# Altium project MultiBoard_Analog.PrjPcb
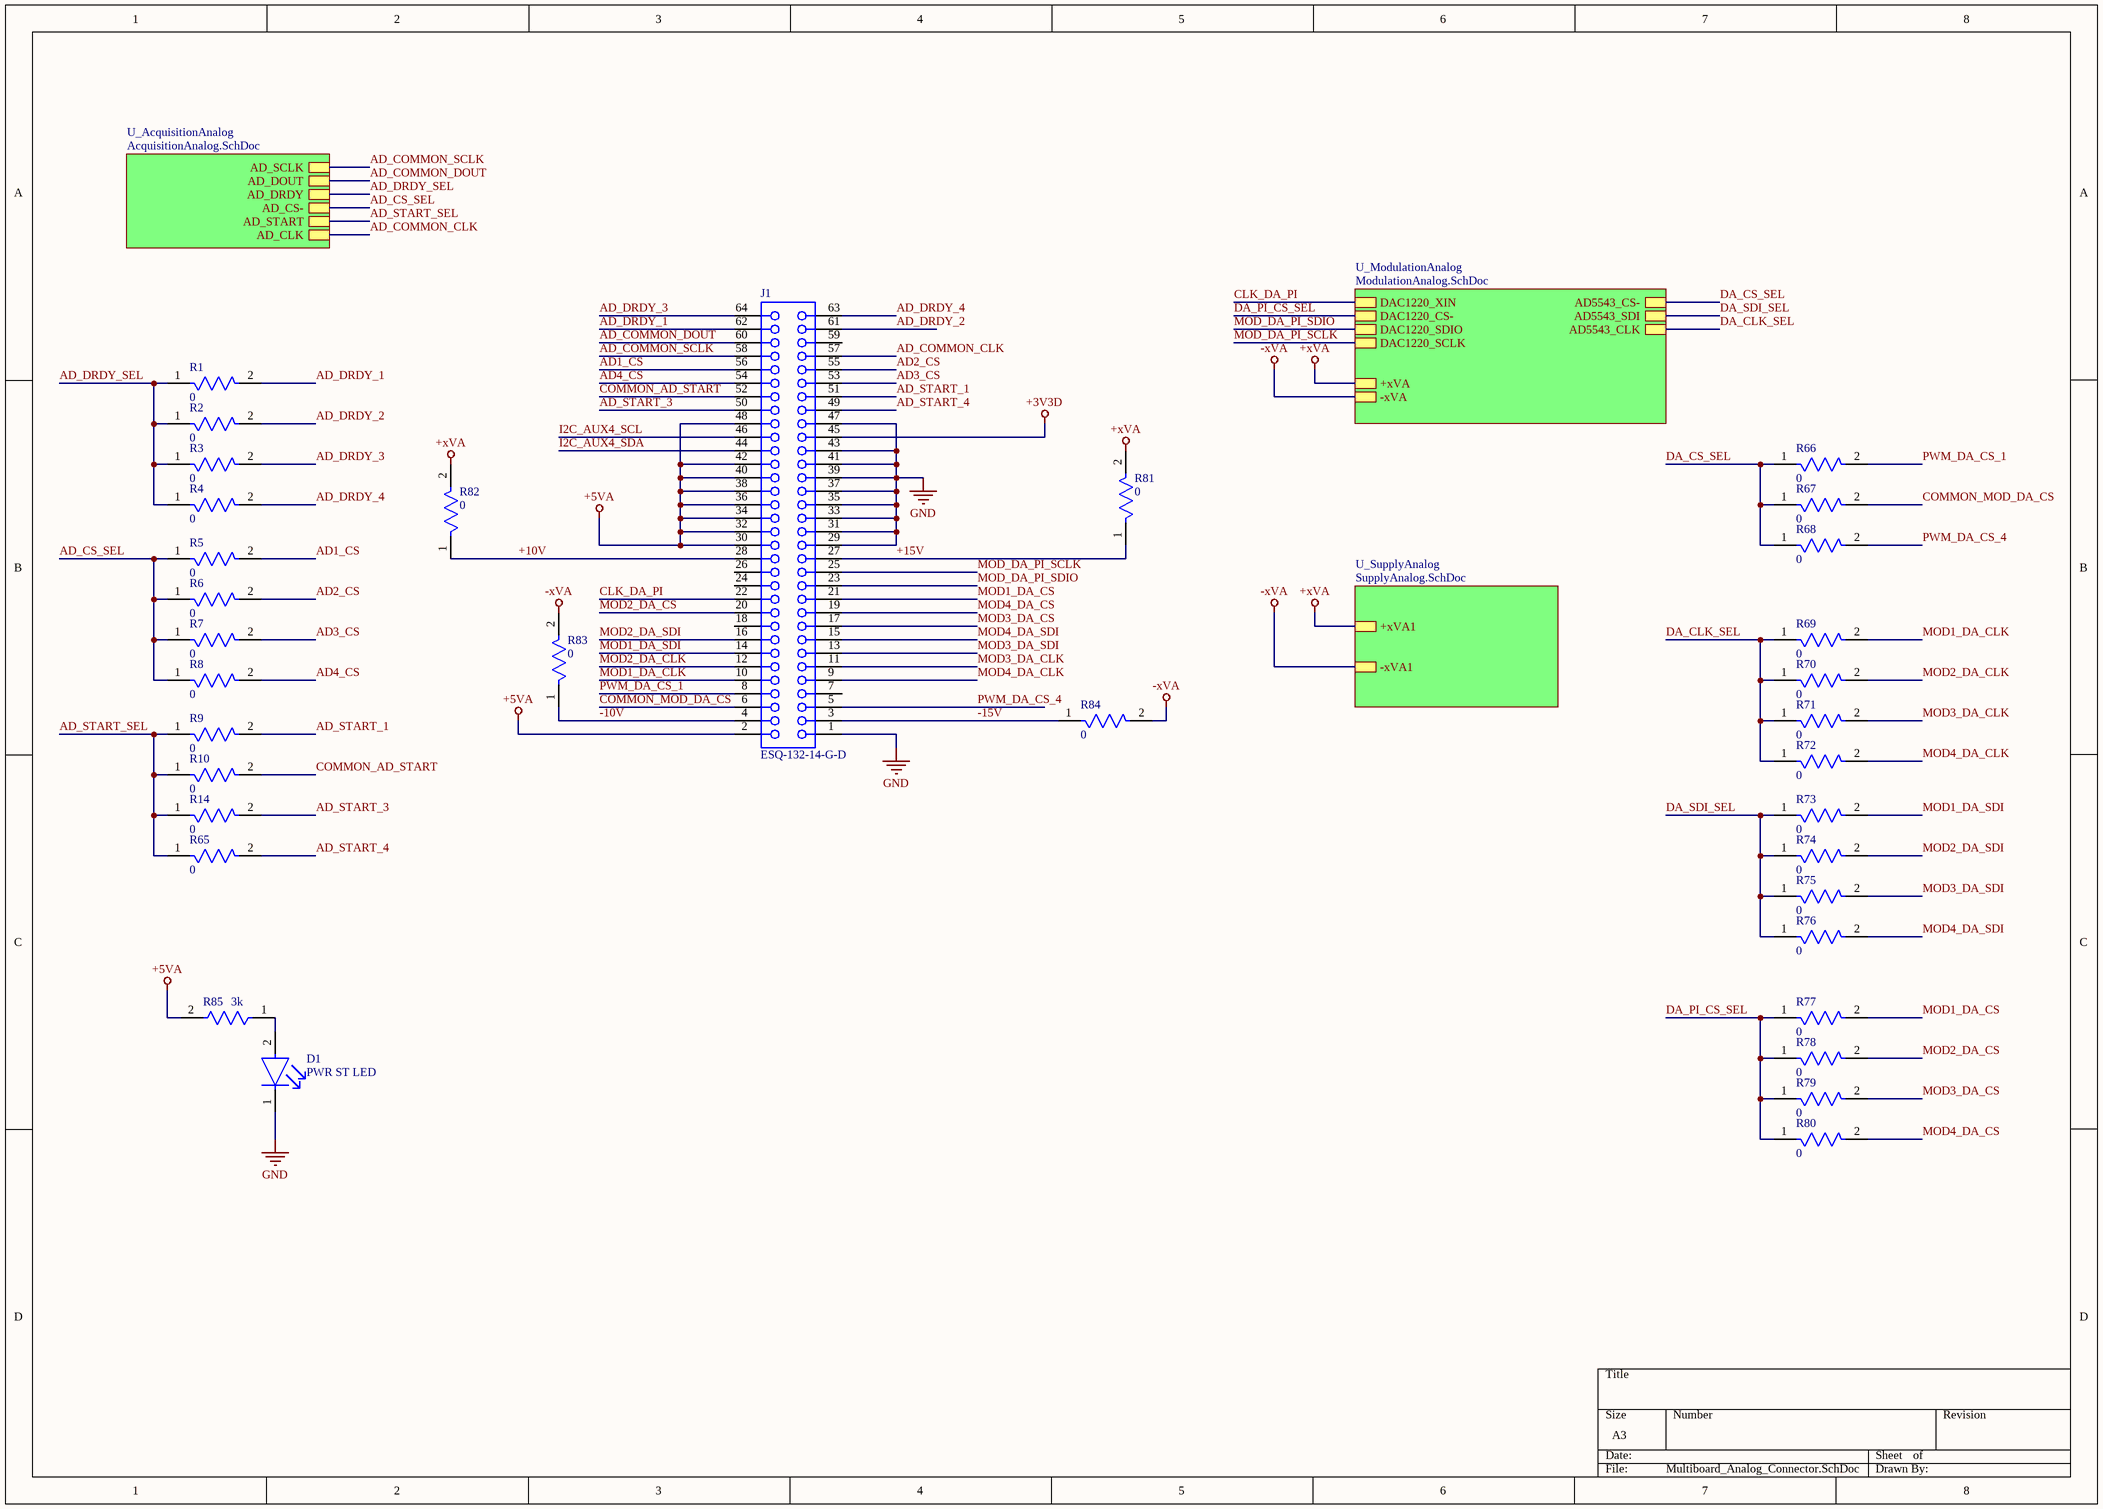
[diagram p0: Multiboard_Analog_Connector.SchDoc]
4 sheets, 213 parts. Net scope: hierarchical (ports join the sheet entries above them; power ports are global).
Board file: MultiBoard_Analog_PCB.PcbDoc
Sheets:
  Multiboard_Analog_Connector.SchDoc
    U_AcquisitionAnalog = AcquisitionAnalog.SchDoc
    U_ModulationAnalog = ModulationAnalog.SchDoc
    U_SupplyAnalog = SupplyAnalog.SchDoc

## Sheet Multiboard_Analog_Connector.SchDoc
size A3; SheetNumber: 1; SheetTotal: 4

### Parts
D1  PWR ST LED  [FP-APHCM2012SYCK-F01-MFG]
J1  ESQ-132-14-G-D  [SMTC-ESQ-132-14-X-D]
R1  0  [FP-RR1220-MFG]
R2  0  [FP-RR1220-MFG]
R3  0  [FP-RR1220-MFG]
R4  0  [FP-RR1220-MFG]
R5  0  [FP-RR1220-MFG]
R6  0  [FP-RR1220-MFG]
R7  0  [FP-RR1220-MFG]
R8  0  [FP-RR1220-MFG]
R9  0  [FP-RR1220-MFG]
R10  0  [FP-RR1220-MFG]
R14  0  [FP-RR1220-MFG]
R65  0  [FP-RR1220-MFG]
R66  0  [FP-RR1220-MFG]
R67  0  [FP-RR1220-MFG]
R68  0  [FP-RR1220-MFG]
R69  0  [FP-RR1220-MFG]
R70  0  [FP-RR1220-MFG]
R71  0  [FP-RR1220-MFG]
R72  0  [FP-RR1220-MFG]
R73  0  [FP-RR1220-MFG]
R74  0  [FP-RR1220-MFG]
R75  0  [FP-RR1220-MFG]
R76  0  [FP-RR1220-MFG]
R77  0  [FP-RR1220-MFG]
R78  0  [FP-RR1220-MFG]
R79  0  [FP-RR1220-MFG]
R80  0  [FP-RR1220-MFG]
R81  0  [FP-RR1220-MFG]
R82  0  [FP-RR1220-MFG]
R83  0  [FP-RR1220-MFG]
R84  0  [FP-RR1220-MFG]
R85  3k  [FP-RR1220-MFG]

### Sub-sheets
U_AcquisitionAnalog = AcquisitionAnalog.SchDoc: AD_SCLK, AD_DOUT, AD_DRDY, AD_CS-, AD_START, AD_CLK
U_ModulationAnalog = ModulationAnalog.SchDoc: DAC1220_XIN, DAC1220_CS-, DAC1220_SDIO, DAC1220_SCLK, AD5543_SDI, AD5543_CLK, AD5543_CS-, +xVA, -xVA
U_SupplyAnalog = SupplyAnalog.SchDoc: +xVA1, -xVA1

### Nets
+3V3D: J1.45
+5VA: J1.2 J1.30 J1.32 J1.34 J1.36 J1.38 J1.40 J1.42 J1.48 R85.2
+xVA: R81.2 R82.2 ; sheet U_ModulationAnalog/+xVA, sheet U_SupplyAnalog/+xVA1  [project net +xV]
-xVA: R83.2 R84.2 ; sheet U_ModulationAnalog/-xVA, sheet U_SupplyAnalog/-xVA1  [project net -xV]
GND: D1.1(C) J1.1 J1.29 J1.31 J1.33 J1.35 J1.37 J1.39 J1.41 J1.43 J1.47
+10V: J1.28 R82.1
+15V: J1.27 R81.1
-10V: J1.4 R83.1
-15V: J1.3 R84.1
AD1_CS: J1.56 R5.2
AD2_CS: J1.55 R6.2
AD3_CS: J1.53 R7.2
AD4_CS: J1.54 R8.2
AD_COMMON_CLK: J1.57 ; sheet U_AcquisitionAnalog/AD_CLK  [project net AD_CLK_IN]
AD_COMMON_DOUT: J1.60 ; sheet U_AcquisitionAnalog/AD_DOUT
AD_COMMON_SCLK: J1.58 ; sheet U_AcquisitionAnalog/AD_SCLK
AD_CS_SEL: R5.1 R6.1 R7.1 R8.1 ; sheet U_AcquisitionAnalog/AD_CS-
AD_DRDY_1: J1.62 R1.2
AD_DRDY_2: J1.61 R2.2
AD_DRDY_3: J1.64 R3.2
AD_DRDY_4: J1.63 R4.2
AD_DRDY_SEL: R1.1 R2.1 R3.1 R4.1 ; sheet U_AcquisitionAnalog/AD_DRDY
AD_START_1: J1.51 R9.2
AD_START_3: J1.50 R14.2
AD_START_4: J1.49 R65.2
AD_START_SEL: R9.1 R10.1 R14.1 R65.1 ; sheet U_AcquisitionAnalog/AD_START
CLK_DA_PI: J1.22 ; sheet U_ModulationAnalog/DAC1220_XIN
COMMON_AD_START: J1.52 R10.2
COMMON_MOD_DA_CS: J1.6 R67.2
DA_CLK_SEL: R69.1 R70.1 R71.1 R72.1 ; sheet U_ModulationAnalog/AD5543_CLK
DA_CS_SEL: R66.1 R67.1 R68.1 ; sheet U_ModulationAnalog/AD5543_CS-  [project net DA_CS]
DA_PI_CS_SEL: R77.1 R78.1 R79.1 R80.1 ; sheet U_ModulationAnalog/DAC1220_CS-
DA_SDI_SEL: R73.1 R74.1 R75.1 R76.1 ; sheet U_ModulationAnalog/AD5543_SDI
I2C_AUX4_SCL: J1.46
I2C_AUX4_SDA: J1.44
MOD1_DA_CLK: J1.10 R69.2
MOD1_DA_CS: J1.21 R77.2
MOD1_DA_SDI: J1.14 R73.2
MOD2_DA_CLK: J1.12 R70.2
MOD2_DA_CS: J1.20 R78.2
MOD2_DA_SDI: J1.16 R74.2
MOD3_DA_CLK: J1.11 R71.2
MOD3_DA_CS: J1.17 R79.2
MOD3_DA_SDI: J1.13 R75.2
MOD4_DA_CLK: J1.9 R72.2
MOD4_DA_CS: J1.19 R80.2
MOD4_DA_SDI: J1.15 R76.2
MOD_DA_PI_SCLK: J1.25 ; sheet U_ModulationAnalog/DAC1220_SCLK
MOD_DA_PI_SDIO: J1.23 ; sheet U_ModulationAnalog/DAC1220_SDIO
PWM_DA_CS_1: J1.8 R66.2
PWM_DA_CS_4: J1.5 R68.2
NetD1_2: D1.2(A) R85.1

Not connected (* = marked no-connect by the designer): J1 7 18 24 26 59

### Library data of the parts
D1 = CMP-44529-000064-1: LED YELLOW CLEAR CHIP SMD; Number of LEDs: 1; Luminous Intensity: 150mcd; Dominant Wavelength: 590nm; Test Current: 20mA; Illumination Color: Green; Forward Voltage: 2V; Viewing Angle: 110°; Number of Pins: 2; Packaging: Tape and Reel; Width: 1.25mm; Height: 0.4mm; Lens Color: Clear; RoHS Compliant: Yes; Lead Free: Lead Free; Min Operating Temperature: -40°C; Case Code (Imperial): 0805; Case/Package: 0805; Series: APHCM; Wavelength: 590nm; Max Operating Temperature: 85°C; Length: 2mm; Color: Yellow; Package Quantity: 2000; Mount: Surface Mount; Lens Style: Clear; Forward Current: 20mA; Case Code (Metric): 2012
J1 = CMP-1026-00064-1: PC/104(TM) Elevated Socket Strip, Through-hole, Vertical, -55 to 125 degC, 2.54 mm Pitch, 64-Pin, Female, RoHS; Manufacturer: Samtec; Pitch: 2.54 mm; System: Connector; DatasheetVersion: F-214; Mounting Technology: Through-hole; RoHS: True; PackageReference: ESQ-132-14-X-D; PackageVersion: BZ, 9/1998; Orientation: Vertical; ComponentLink3URL: http://www.samtec.com/documents/webfiles/cpdf/ESQ-1XX-XX-X-X-XXX-XX-X-XX-MKT.pdf; ComponentLink1URL: http://www.samtec.com; PartNumber: ESQ-132-14-G-D; ComponentLink2URL: http://www.samtec.com/documents/webfiles/pdf/ESQ_TH.PDF; ComponentLink3Description: Package Specification; ComponentLink1Description: Manufacturer URL; PackageDescription: ESQ Strip ASM; Temperature Range: -55 to 125 degC; ComponentLink2Description: Datasheet
R1-R10 R14 R65-R85 = CMP-2001-03560-2: 49.9Ω ±0.5% 0.1W 1/10W Chip Resistor 0805 (2012 Metric) Thin Film; Voltage Rating: 100V; Temperature Coefficient: 50ppm/°C; Max Power Dissipation: 100mW; Resistance: 49.9R; Packaging: Tape and Reel; Length: 0.079inch; Termination: SMD/SMT; Case Code (Metric): 2012; Voltage Rating (DC): 100V; Height: 0.02inch; Width: 0.049inch; RoHS Compliant: Yes; Tolerance: 0.5%; Case/Package: 0805; Resistance Tolerance: 0.5%; Lead Free: Lead Free; Size Code: 0805; Min Operating Temperature: -55°C; Max Operating Temperature: 125°C; Case Code (Imperial): 0805; Package Quantity: 1; Resistor Type: Thin Film; Number of Terminations: 2; Power Rating: 100mW; Series: RR

## Sheet AcquisitionAnalog.SchDoc
size A3; SheetNumber: 2; SheetTotal: 4
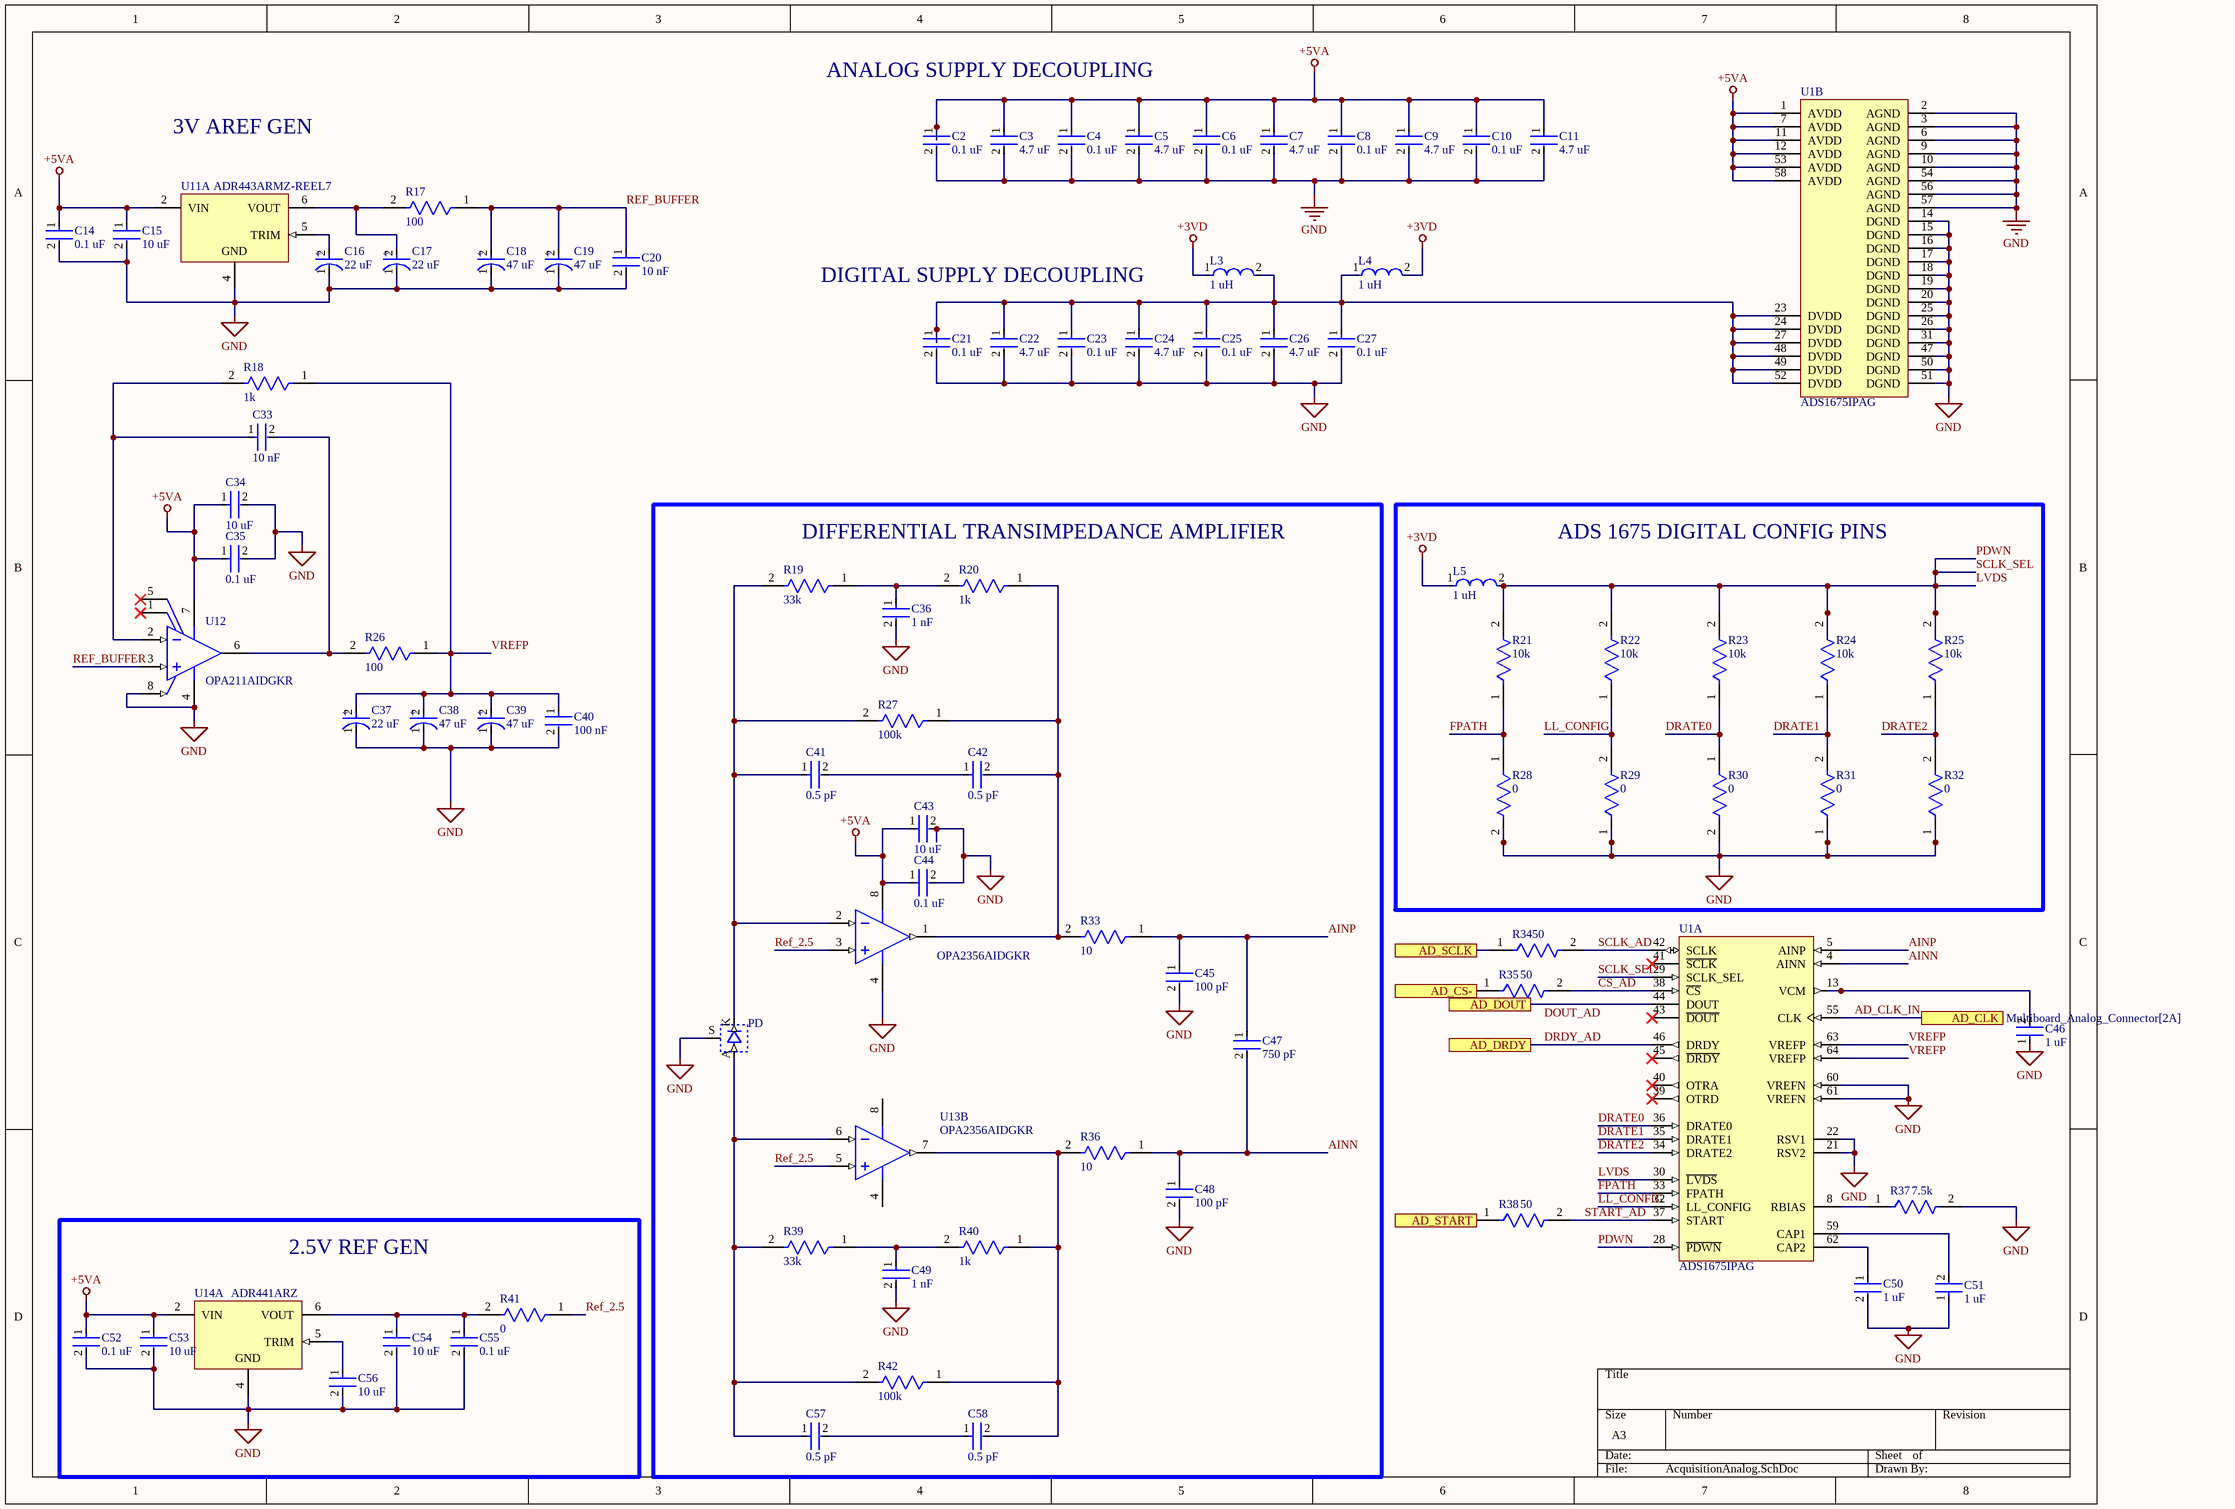
[diagram p1: AcquisitionAnalog.SchDoc]

### Parts
C2  0.1 uF  [FP-CC0805-0_85-MFG]
C3  4.7 uF  [FP-CC0805-0_85-MFG]
C4  0.1 uF  [FP-CC0805-0_85-MFG]
C5  4.7 uF  [FP-CC0805-0_85-MFG]
C6  0.1 uF  [FP-CC0805-0_85-MFG]
C7  4.7 uF  [FP-CC0805-0_85-MFG]
C8  0.1 uF  [FP-CC0805-0_85-MFG]
C9  4.7 uF  [FP-CC0805-0_85-MFG]
C10  0.1 uF  [FP-CC0805-0_85-MFG]
C11  4.7 uF  [FP-CC0805-0_85-MFG]
C14  0.1 uF  [FP-CC0805-0_85-MFG]
C15  10 uF  [FP-CC0805-0_85-MFG]
C16  22 uF  [FP-TAJP-MFG]
C17  22 uF  [FP-TAJP-MFG]
C18  47 uF  [FP-TAJP-MFG]
C19  47 uF  [FP-TAJP-MFG]
C20  10 nF  [FP-CC0805-0_85-MFG]
C21  0.1 uF  [FP-CC0805-0_85-MFG]
C22  4.7 uF  [FP-CC0805-0_85-MFG]
C23  0.1 uF  [FP-CC0805-0_85-MFG]
C24  4.7 uF  [FP-CC0805-0_85-MFG]
C25  0.1 uF  [FP-CC0805-0_85-MFG]
C26  4.7 uF  [FP-CC0805-0_85-MFG]
C27  0.1 uF  [FP-CC0805-0_85-MFG]
C33  10 nF  [FP-CC0805-0_85-MFG]
C34  10 uF  [FP-CC0805-0_85-MFG]
C35  0.1 uF  [FP-CC0805-0_85-MFG]
C36  1 nF  [FP-CC0805-0_85-MFG]
C37  22 uF  [FP-TAJP-MFG]
C38  47 uF  [FP-TAJP-MFG]
C39  47 uF  [FP-TAJP-MFG]
C40  100 nF  [FP-CC0805-0_85-MFG]
C41  0.5 pF  [FP-CC0805-0_85-MFG]
C42  0.5 pF  [FP-CC0805-0_85-MFG]
C43  10 uF  [FP-CC0805-0_85-MFG]
C44  0.1 uF  [FP-CC0805-0_85-MFG]
C45  100 pF  [FP-CC0805-0_85-MFG]
C46  1 uF  [FP-CC0805-0_85-MFG]
C47  750 pF  [FP-CC0805-0_85-MFG]
C48  100 pF  [FP-CC0805-0_85-MFG]
C49  1 nF  [FP-CC0805-0_85-MFG]
C50  1 uF  [FP-CC0805-0_85-MFG]
C51  1 uF  [FP-CC0805-0_85-MFG]
C52  0.1 uF  [FP-CC0805-0_85-MFG]
C53  10 uF  [FP-CC0805-0_85-MFG]
C54  10 uF  [FP-CC0805-0_85-MFG]
C55  0.1 uF  [FP-CC0805-0_85-MFG]
C56  10 uF  [FP-CC0805-0_85-MFG]
C57  0.5 pF  [FP-CC0805-0_85-MFG]
C58  0.5 pF  [FP-CC0805-0_85-MFG]
L3  1 uH  [FP-LQM21DN_00-IPC_B]
L4  1 uH  [FP-LQM21DN_00-IPC_B]
L5  1 uH  [FP-LQM21DN_00-IPC_B]
PD  (no value)  [otico]
R17  100  [FP-RR1220-MFG]
R18  1k  [FP-RR1220-MFG]
R19  33k  [FP-RR1220-MFG]
R20  1k  [FP-RR1220-MFG]
R21  10k  [FP-RR1220-MFG]
R22  10k  [FP-RR1220-MFG]
R23  10k  [FP-RR1220-MFG]
R24  10k  [FP-RR1220-MFG]
R25  10k  [FP-RR1220-MFG]
R26  100  [FP-RR1220-MFG]
R27  100k  [FP-RR1220-MFG]
R28  0  [FP-RR1220-MFG]
R29  0  [FP-RR1220-MFG]
R30  0  [FP-RR1220-MFG]
R31  0  [FP-RR1220-MFG]
R32  0  [FP-RR1220-MFG]
R33  10  [FP-RR1220-MFG]
R34  50  [FP-RR1220-MFG]
R35  50  [FP-RR1220-MFG]
R36  10  [FP-RR1220-MFG]
R37  7.5k  [FP-RR1220-MFG]
R38  50  [FP-RR1220-MFG]
R39  33k  [FP-RR1220-MFG]
R40  1k  [FP-RR1220-MFG]
R41  0  [FP-RR1220-MFG]
R42  100k  [FP-RR1220-MFG]
U1  ADS1675IPAG  [TI-PAG64_L]  (parts A,B of 2)
U11  ADR443ARMZ-REEL7  [ADI-RM-8_L]  (part A of 2)
U12  OPA211AIDGKR  [DGK0008A_M]
U13  OPA2356AIDGKR  [DGK0008A_M]  (parts A,B of 2)
U14  ADR441ARZ  [ADI-R-8_L]  (part A of 2)

### Blocks framed on the sheet
DIFFERENTIAL TRANSIMPEDANCE AMPLIFIER: C36 C41-C45 C47-C49 C57 C58 PD R19 R20 R27 R33 R36 R39 R40 R42 U13
ADS 1675 DIGITAL CONFIG PINS: L5 R21-R25 R28-R32
2.5V REF GEN: C52-C56 R41 U14

### Ports
AD_CLK (see Multiboard_Analog_Connector[2A]), AD_CS- (see Multiboard_Analog_Connector[2A]), AD_DOUT (see Multiboard_Analog_Connector[2A]), AD_DRDY (see Multiboard_Analog_Connector[2A]), AD_SCLK (see Multiboard_Analog_Connector[2A]), AD_START (see Multiboard_Analog_Connector[2A])

### Nets
+3VD: L3.1 L4.2 L5.1
+5VA: C2.1 C3.1 C4.1 C5.1 C6.1 C7.1 C8.1 C9.1 C10.1 C11.1 C14.1 C15.1 C34.1 C35.1 C43.1 C44.1 C52.1 C53.1 U1.1(AVDD) U1.7(AVDD) U1.11(AVDD) U1.12(AVDD) U1.53(AVDD) U1.58(AVDD) U11.2(VIN) U12.7(V+) U13.8(V+) U14.2(VIN)
GND: C2.2 C3.2 C4.2 C5.2 C6.2 C7.2 C8.2 C9.2 C10.2 C11.2 C14.2 C15.2 C16.1(C) C17.1(C) C18.1(C) C19.1(C) C20.2 C21.2 C22.2 C23.2 C24.2 C25.2 C26.2 C27.2 C34.2 C35.2 C36.2 C37.1(C) C38.1(C) C39.1(C) C40.2 C43.2 C44.2 C45.2 C46.1 C48.2 C49.2 C50.2 C51.1 C52.2 C53.2 C54.2 C55.2 C56.2 PD.S R28.2 R29.1 R30.2 R31.1 R32.1 R37.2 U1.2(AGND) U1.3(AGND) U1.6(AGND) U1.9(AGND) U1.10(AGND) U1.14(DGND) U1.15(DGND) U1.16(DGND) U1.17(DGND) U1.18(DGND) U1.19(DGND) U1.20(DGND) U1.21(RSV2) U1.22(RSV1) U1.25(DGND) U1.26(DGND) U1.31(DGND) U1.47(DGND) U1.50(DGND) U1.51(DGND) U1.54(AGND) U1.56(AGND) U1.57(AGND) U1.60(VREFN) U1.61(VREFN) U11.4(GND) U12.4(V-) U12.8(SHUTDOWN) U13.4(V-) U14.4(GND)
AD_CLK_IN: U1.55(CLK) ; port AD_CLK
AD_COMMON_SCLK: R34.1 ; port AD_SCLK
AD_CS_SEL: R35.1 ; port AD_CS-
AD_START_SEL: R38.1 ; port AD_START
AINN: C47.2 C48.1 R36.1 U1.4(AINN)
AINP: C45.1 C47.1 R33.1 U1.5(AINP)
CS_AD: R35.2 U1.38(~{CS})
DOUT_AD: U1.44(DOUT) ; port AD_DOUT  [project net AD_COMMON_DOUT]
DRATE0: R23.1 R30.1 U1.36(DRATE0)
DRATE1: R24.1 R31.2 U1.35(DRATE1)
DRATE2: R25.1 R32.2 U1.34(DRATE2)
DRDY_AD: U1.46(DRDY) ; port AD_DRDY  [project net AD_DRDY_SEL]
FPATH: R21.1 R28.1 U1.33(FPATH)
LL_CONFIG: R22.1 R29.2 U1.32(LL_CONFIG)
LVDS: L5.2 R21.2 R22.2 R23.2 R24.2 R25.2 U1.28(~{PDWN}) U1.29(SCLK_SEL) U1.30(~{LVDS})  [also labelled PDWN, SCLK_SEL]
Ref_2.5: R41.1 U13.3(IN_A+) U13.5(IN_B+)
REF_BUFFER: C18.2(A) C19.2(A) C20.1 R17.1 U12.3(IN+)
SCLK_AD: R34.2 U1.42(SCLK)
START_AD: R38.2 U1.37(START)
VREFP: C37.2(A) C38.2(A) C39.2(A) C40.1 R18.1 R26.1 U1.63(VREFP) U1.64(VREFP)
NetC16_2: C16.2(A) U11.5(TRIM)
NetC17_2: C17.2(A) R17.2 U11.6(VOUT)
NetC21_1: C21.1 C22.1 C23.1 C24.1 C25.1 C26.1 C27.1 L3.2 L4.1 U1.23(DVDD) U1.24(DVDD) U1.27(DVDD) U1.48(DVDD) U1.49(DVDD) U1.52(DVDD)
NetC33_1: C33.1 R18.2 U12.2(IN-)
NetC33_2: C33.2 R26.2 U12.6(OUT)
NetC36_1: C36.1 R19.1 R20.2
NetC41_1: C41.1 PD.K R19.2 R27.2 U13.2(IN_A-)
NetC41_2: C41.2 C42.1
NetC42_2: C42.2 R20.1 R27.1 R33.2 U13.1(OUT_A)
NetC46_2: C46.2 U1.13(VCM)
NetC49_1: C49.1 R39.1 R40.2
NetC50_1: C50.1 U1.62(CAP2)
NetC51_2: C51.2 U1.59(CAP1)
NetC54_1: C54.1 C55.1 R41.2 U14.6(VOUT)
NetC56_1: C56.1 U14.5(TRIM)
NetC57_1: C57.1 PD.A R39.2 R42.2 U13.6(IN_B-)
NetC57_2: C57.2 C58.1
NetC58_2: C58.2 R36.2 R40.1 R42.1 U13.7(OUT_B)
NetR37_1: R37.1 U1.8(RBIAS)

Not connected (* = marked no-connect by the designer): U1 39(OTRD)* 40(OTRA)* 41(~{SCLK})* 43(~{DOUT})* 45(~{DRDY})*; U12 1(NC)* 5(NC)*

### Notes on the sheet
- ANALOG SUPPLY DECOUPLING
- 3V AREF GEN
- DIGITAL SUPPLY DECOUPLING
- (in symbol CMP-2007-04028-2) +

### Library data of the parts
C2-C11 C14 C15 C20-C27 C33-C36 C41-C58 = CMP-1036-04410-2: CAP CER 0.1UF 25V X7R 0805; Manufacturer Part Number: CC0805KRX7R8BB104; Manufacturer: Yageo; Tolerance: 0.1; Material: Ceramic; Value: 100 nF; ComponentLink2URL: http://www.yageo.com/documents/recent/UPY-GPHC_Y5V_6.3V-to-50V_8.pdf; Category: Cap; Mouser Description: Multilayer Ceramic Capacitors MLCC - SMD/SMT 100nF 25V X7R 10%; Device Class L1: Passive Components; Footprint Url: http://www.yageo.com/exep/pages/download/literatures/UPY-C_GEN_24.pdf; Height: 0.95mm; Digikey Description: CAP CER 0.1UF 25V X7R 0805; Lead Free: Yes; Temperature Range High: +85°C; Temperature: -30°C to +85°C; Ipc Land Pattern Name: CAPC200125X85; Capacitance: 100 nF; Automotive: No; Octopart: https://octopart.com/cc0805krx7r8bb104-yageo-39467766; Device Class L2: Capacitors; Temperature Characteristic: X7R; Voltage Rating: 25 V; ComponentLink2Description: Datasheet; Temperature Range Low: -30°C; Device Class L3: Ceramic Capacitors; RoHS: TRUE; Package: CC0805-0.85
C16-C19 C37-C39 = CMP-2007-04028-2: 10uF 10V  ±20% 6Ω 0805  SMD Tantalum Capacitor; Dissipation Factor: 8%; ESR (Equivalent Series Resistance): 6R; Polarity: Polar; Leakage Current: 1uA; Height: 1.5mm; Packaging: Tape and Reel; Max Operating Temperature: 125°C; Lead Free: Lead Free; Length: 2.05mm; RoHS Compliant: Yes; Number of Pins: 2; Case Code (Metric): 2012; Series: TAJ; Height - Seated (Max): 0.059inch; Mount: Surface Mount; REACH SVHC: No SVHC; Depth: 1.35mm; Tolerance: 20%; Case Code (Imperial): 0805; Dielectric Material: Tantalum; Features: General Purpose; Voltage: 10V; Capacitance: 10uF; Package Quantity: 1; Case/Package: 0805; Voltage Rating (DC): 10V; Termination: SMD/SMT; Width: 0.053inch; Min Operating Temperature: -55°C; Voltage Rating: 10V
C40 = CMP-1036-04410-2: CAP CER 0.1UF 25V X7R 0805; Manufacturer Part Number: CC0805KRX7R8BB104; Manufacturer: Yageo; Tolerance: 0.1; Material: Ceramic; ComponentLink2URL: http://www.yageo.com/documents/recent/UPY-GPHC_Y5V_6.3V-to-50V_8.pdf; Category: Cap; Mouser Description: Multilayer Ceramic Capacitors MLCC - SMD/SMT 100nF 25V X7R 10%; Device Class L1: Passive Components; Footprint Url: http://www.yageo.com/exep/pages/download/literatures/UPY-C_GEN_24.pdf; Height: 0.95mm; Digikey Description: CAP CER 0.1UF 25V X7R 0805; Lead Free: Yes; Temperature Range High: +85°C; Temperature: -30°C to +85°C; Ipc Land Pattern Name: CAPC200125X85; Value: 100 nF; Capacitance: 100 nF; Automotive: No; Octopart: https://octopart.com/cc0805krx7r8bb104-yageo-39467766; Device Class L2: Capacitors; Temperature Characteristic: X7R; Voltage Rating: 25 V; ComponentLink2Description: Datasheet; Temperature Range Low: -30°C; Device Class L3: Ceramic Capacitors; RoHS: TRUE; Package: CC0805-0.85
L3-L5 = CMP-06042-012978-1: Multilayer Type Inductor for General Circuits, 0805 (2012), 1μH, 10%, 0.4Ω, 50mA; Q Factor: 45; Test Frequency: 10MHz; DC Resistance (DCR): 400mR; Core Material: Ferrite; Shielding: Shielded; Inductance: 1uH; Self Resonant Frequency: 107MHz; Mount: Surface Mount; Depth: 1.45mm; Current Rating: 50mA; Lead Free: Lead Free; Height - Seated (Max): 0.041inch; Inductance Tolerance: 10%; Min Operating Temperature: -40°C; Height: 0.85mm; Radiation Hardening: No; Width: 1.25mm; Length: 2mm; Case Code (Imperial): 0805; Termination: SMD/SMT; Package Quantity: 1; Max Operating Temperature: 85°C; Case Code (Metric): 2012; Case/Package: 0805; Max DC Current: 50mA; DC Current: 50mA; Military Standard: Not; REACH SVHC: No SVHC; Packaging: Tape and Reel; Tolerance: 10%
PD = BYW29-150: Text Field1: 10; Text Field2: 20
R17-R42 = CMP-2001-03560-2: as R1 on sheet Multiboard_Analog_Connector; Packaging: Tape and Reel; Length: 0.079inch; Termination: SMD/SMT; Case Code (Metric): 2012; Voltage Rating (DC): 100V; Height: 0.02inch; Width: 0.049inch; RoHS Compliant: Yes; Tolerance: 0.5%; Case/Package: 0805; Resistance Tolerance: 0.5%; Lead Free: Lead Free; Size Code: 0805; Min Operating Temperature: -55°C; Max Operating Temperature: 125°C; Case Code (Imperial): 0805; Package Quantity: 1; Resistor Type: Thin Film; Number of Terminations: 2; Power Rating: 100mW; Series: RR
U1 = CMP-0003-00593-1: 4 MSPS, 24-Bit ADC, -40 to 85 degC, 64-pin QFP (PAG64), Green (RoHS & no Sb/Br); Manufacturer: Texas Instruments; Analog Voltage AV/DD(Min)(V): 4.75; Analog Voltage AV/DD(Max)(V): 5.25; SFDR(dB): 120; Resolution(Bits): 24; # Input Channels: 1; SubFamily: Precision ADC (<=10MSPS); Architecture: Delta-Sigma; SNR(dB): 92; Digital Supply(Min)(V): 2.85; Sample Rate (max)(SPS): 4M; Digital Supply(Max)(V): 3.15; Interface: Parallel LVDS, Serial SPI; Eco-Plan: Green (RoHS & no Sb/Br); ComponentLink3URL: http://www.ti.com/lit/ml/mtqf006a/mtqf006a.pdf; PackageDescription: 64-Pin Plastic Flat Pack, Body 10 x 10 mm, Pitch 0.50 mm; PackageVersion: 4040282/C, 11/1996; Mounting Technology: Surface Mount; ComponentLink1URL: http://www.ti.com/; ComponentLink2URL: http://www.ti.com/general/docs/lit/getliterature.tsp?genericPartNumber=ADS1675&fileType=pdf; PartNumber: ADS1675IPAG; ComponentLink2Description: Datasheet; ComponentLink3Description: Package Specification; PackageReference: PAG64; ComponentLink1Description: Manufacturer URL; Code_JEDEC: MS-026; DatasheetVersion: SBAS416D
U11 = CMP-0784-00377-1: Ultralow Noise, LDO XFET Voltage Reference with Current Sink and Source, 3 V Output, 3.5 to 18 V Supply, Industrial, 8-pin SOP (RM-8), Reel; Manufacturer: Analog Devices; Ref Out TC (ppm/C): 2; Min V Supply (V): 3.5; Max V Supply (V): 18; Vout: 3V; ComponentLink3URL: http://www.analog.com/static/imported-files/packages/PKG_PDF/MSOP%28RM%29/RM_8.pdf; ComponentLink2URL: http://www.analog.com/static/imported-files/data_sheets/ADR440_441_443_444_445.pdf; ComponentLink2Description: Datasheet; PackageVersion: Aug-05; Mounting Technology: Surface Mount; ComponentLink1Description: Manufacturer URL; PartNumber: ADR443ARMZ-REEL7; DatasheetVersion: Rev. E; PackageDescription: 8-Pin Mini Small Outline Package, Body 3 x 3 mm, Pitch 0.65 mm; ComponentLink4Description: URL Link1; ComponentLink1URL: http://www.analog.com/en/index.html; ComponentLink4URL: Product URL:http://www.analog.com/en/special-linear-functions/voltage-references/adr443/products/product.html; Operating Temp Range: -40 to 125 degC; Code_JEDEC: MO-187-AA; ComponentLink3Description: Package Specification; PackageReference: RM-8; Packing: Reel
U12 = CMP-0272-01174-3: 1.1 nV/rtHz Noise, Low Power, Precision Operational Amplifier, 4.5 to 36 V, -40 to 125 degC, 8-pin SOP (DGK8), Green (RoHS & no Sb/Br); Manufacturer: Texas Instruments; IIB(Max)(pA): 175000; CMRR(Min)(dB): 114; Sub Family: High Supply Voltage Amplifier (>=30V), Low Noise Amp (<=10nV/rtHz), Low Offset Voltage Amplifier (<=500uV), Precision Amplifier; Number of Channels: 1; Total Supply Voltage(Max)(+5V is 5, +/-5V is 10): 36; Packing: LARGE T&R; Slew Rate(Typ)(V/us): 27; Iq per channel(Max)(mA): 4.5; Vio (25C)(Max)(mV): 0.125; GBW(Typ)(MHz): 45; Rating: Catalog; Offset Drift(Typ)(uV/C): 0.15; DatasheetVersion: SBOS377G; ComponentLink2URL: http://www.ti.com/lit/ds/symlink/opa211.pdf; PackageReference: DGK0008A; Mounting Technology: Surface Mount; ComponentLink3URL: http://www.ti.com/litv/pdf/mpds028d; Eco-Plan: Green (RoHS & no Sb/Br); ComponentLink1Description: Manufacturer URL; PartNumber: OPA211AIDGKR; PackageDescription: 8-Pin Thin Small Outline, Body 3 x 3 mm, Pitch 0.65 mm; ComponentLink3Description: Package Specification; Code_JEDEC: MO-187; ComponentLink2Description: Datasheet; PackageVersion: 4073329/E, 05/2006; ComponentLink1URL: http://www.ti.com/; Total Supply Voltage(Min)(+5V is 5, +/-5V is 10): 4.5
U13 = CMP-0018-00589-2: 200 MHz GBW, CMOS Dual Operational Amplifier, 2.5 to 5.5 V, -40 to 125 degC, 8-pin SOP (DGK8), Green (RoHS & no Sb/Br); Manufacturer: Texas Instruments; Slew Rate(Typ)(V/us): 360; Acl, min stable gain(V/V): 1; 3rd Harmonic(dBc): 93; Vs(Min)(V): 2.5; Rail-Rail: Out; Diff Phase(deg): 0.05; 2nd Harmonic(dBc): 81; Vn at Flatband(Typ)(nV/rtHz): 5.8; Number of Channels: 2; Sub Family: High Output Current Amplifier (>=50mA), High Speed Amplifier (>=50MHz), Low Supply Voltage Amplifier (<=2.7V); Diff Gain(%): 0.02; Settling Time (0.1%)(Typ)(ns): 30; Iq per channel(Max)(mA): 14; THD (Fc is 1 MHz)(Typ)(dB): -79; Io(Typ)(mA): 100; Vio(Max)(mV): 9; Vs(Max)(V): 5.5; BW @ Acl(MHz): 450; PackageDescription: 8-Pin Thin Small Outline, Body 3 x 3 mm, Pitch 0.65 mm; PartNumber: OPA2356AIDGKR; Mounting Technology: Surface Mount; Eco-Plan: Green (RoHS & no Sb/Br); Code_JEDEC: MO-187; ComponentLink3Description: Package Specification; ComponentLink1URL: http://www.ti.com/; DatasheetVersion: SBOS212A; ComponentLink2Description: Datasheet; PackageReference: DGK0008A; ComponentLink2URL: http://www.ti.com/general/docs/lit/getliterature.tsp?genericPartNumber=OPA2356&fileType=pdf; ComponentLink1Description: Manufacturer URL; @ MHz: 1; Iib(Max)(nA): 0.05; ComponentLink3URL: http://www.ti.com/litv/pdf/mpds028d; PackageVersion: 4073329/E, 05/2006
U14 = CMP-0784-00172-1: Ultralow Noise, LDO XFET Voltage Reference with Current Sink and Source, 2.5 V Output, 3 to 18 V Supply, Industrial, 8-pin SOIC (R-8), Tube; Manufacturer: Analog Devices; Vout: 2.5V; Ref Out TC (ppm/C): 2; Min V Supply (V): 3; Max V Supply (V): 18; Packing: Tube; ComponentLink2URL: http://www.analog.com/static/imported-files/data_sheets/ADR440_441_443_444_445.pdf; PackageVersion: 060506-A, 06/2006; PartNumber: ADR441ARZ; PackageDescription: 8-Pin Standard Small Outline Package, Body 4.9 x 3.9 mm, Pitch 1.27 mm; PackageReference: R-8; ComponentLink2Description: Datasheet; ComponentLink3URL: http://www.analog.com/static/imported-files/packages/PKG_PDF/SOIC_Narrow%20(R)/R_8.pdf; Operating Temp Range: -40 to 125 degC; ComponentLink3Description: Package Specification; ComponentLink1Description: Manufacturer URL; Code_JEDEC: MS-012-AA; ComponentLink1URL: http://www.analog.com/en/index.html; DatasheetVersion: Rev. E; ComponentLink4URL: Product URL:http://www.analog.com/en/special-linear-functions/voltage-references/adr441/products/product.html; Mounting Technology: Surface Mount; ComponentLink4Description: URL Link1

## Sheet ModulationAnalog.SchDoc
size A3; SheetNumber: 3; SheetTotal: 4
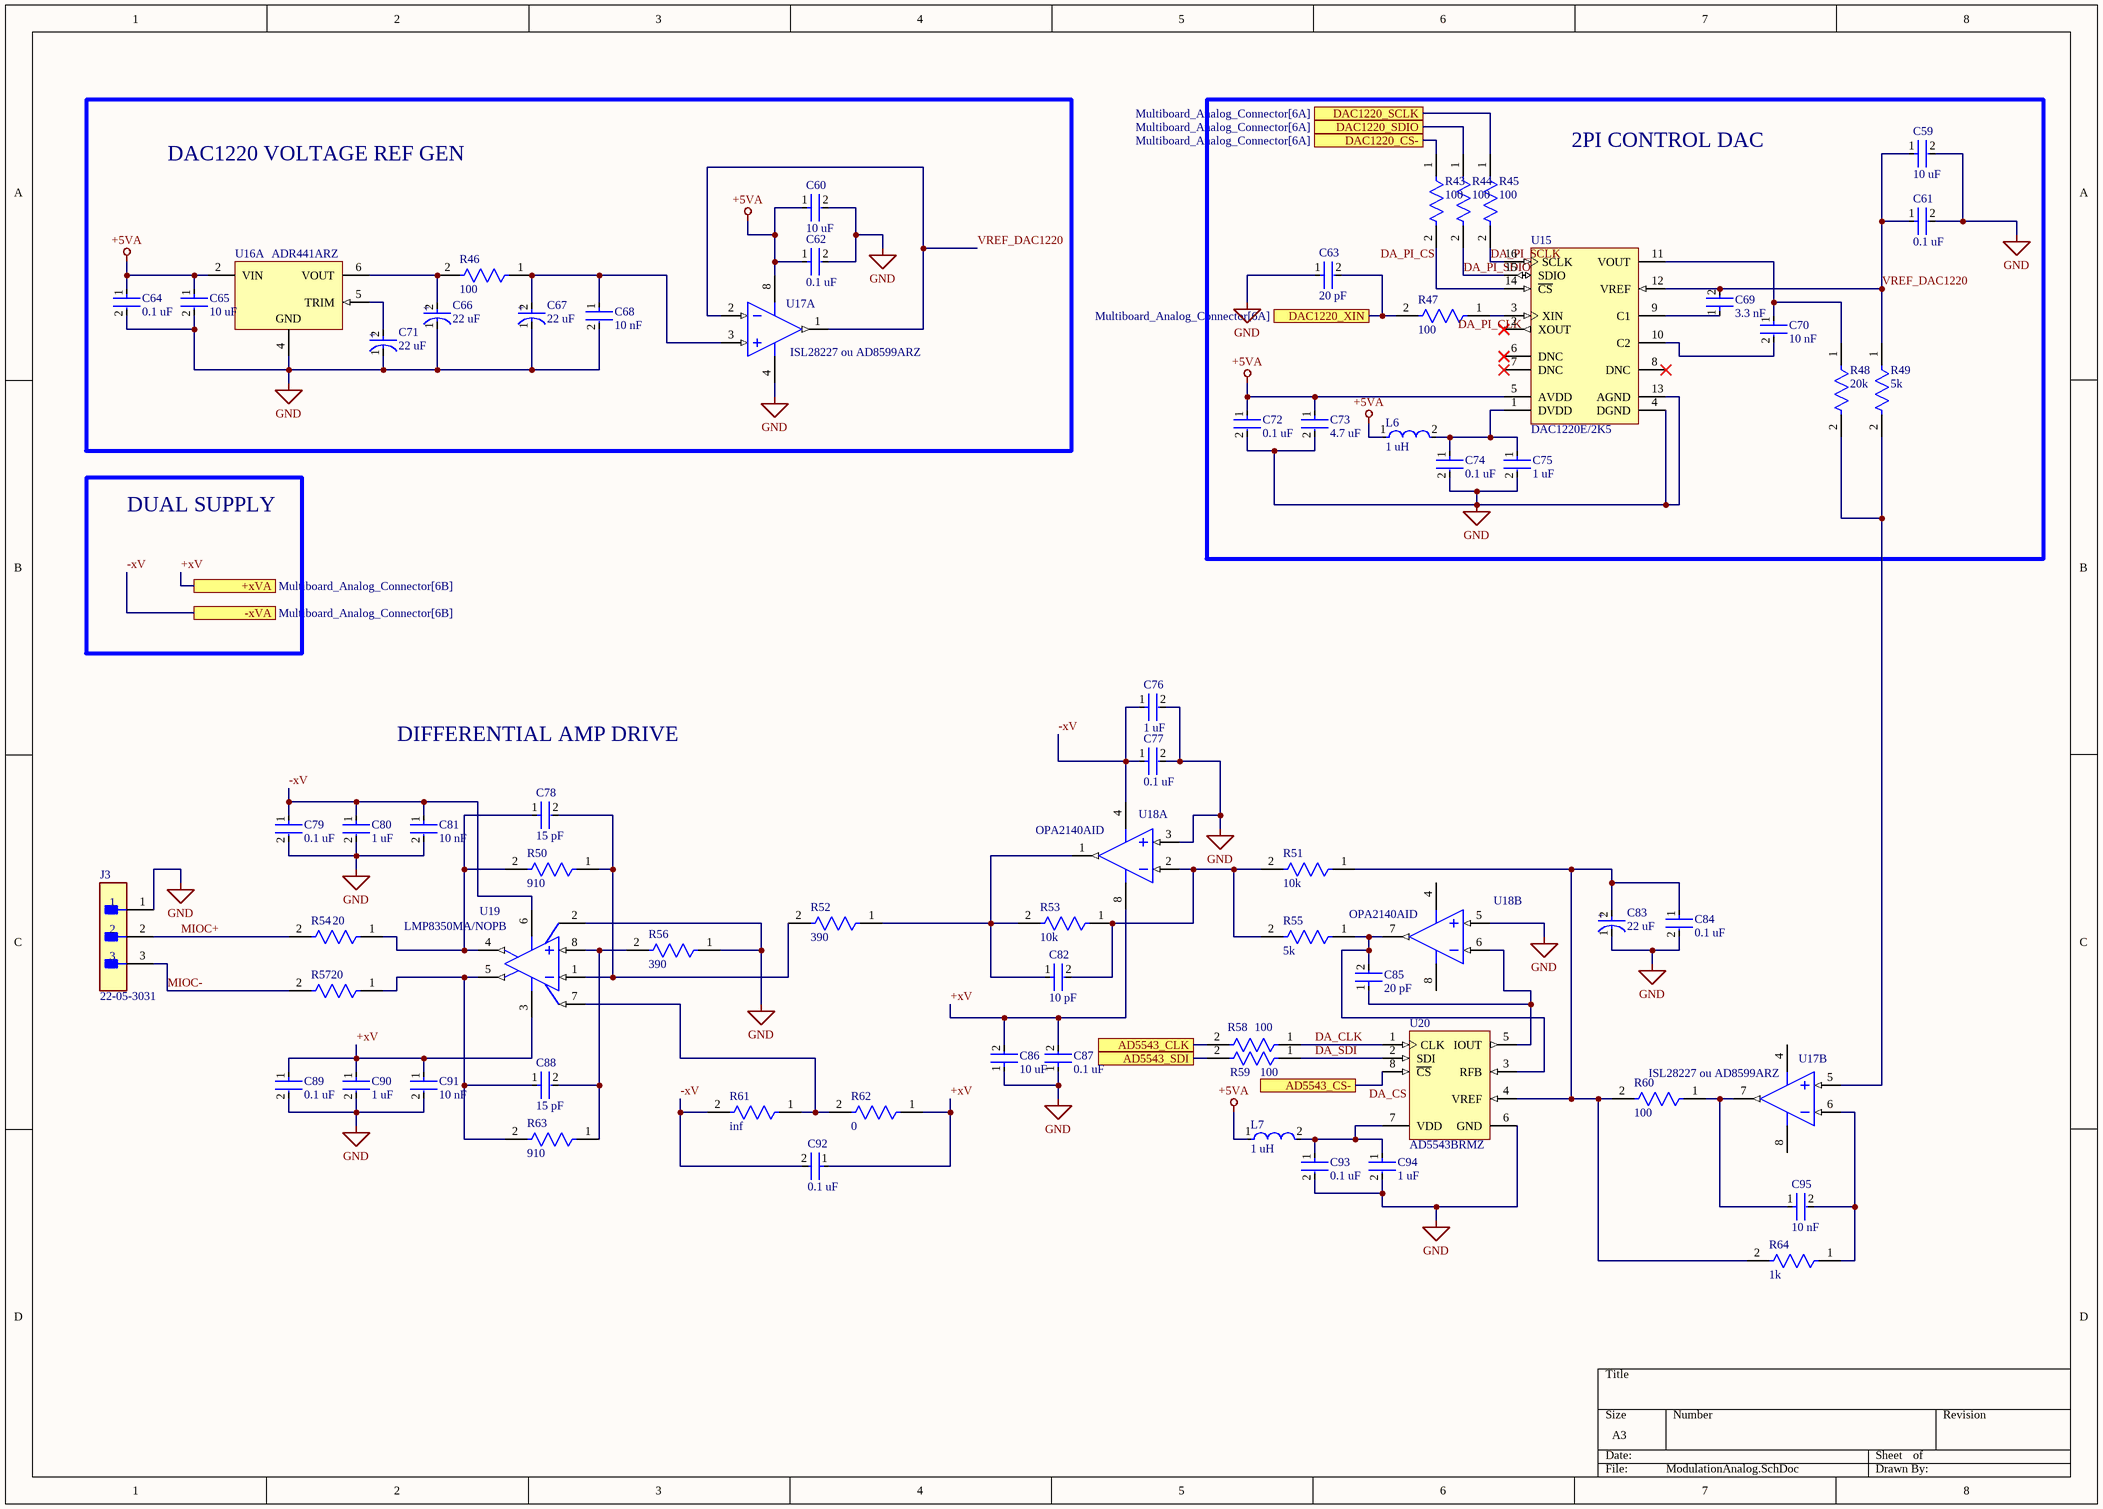
[diagram p2: ModulationAnalog.SchDoc]

### Parts
C59  10 uF  [FP-CC0805-0_85-MFG]
C60  10 uF  [FP-CC0805-0_85-MFG]
C61  0.1 uF  [FP-CC0805-0_85-MFG]
C62  0.1 uF  [FP-CC0805-0_85-MFG]
C63  20 pF  [FP-CC0805-0_85-MFG]
C64  0.1 uF  [FP-CC0805-0_85-MFG]
C65  10 uF  [FP-CC0805-0_85-MFG]
C66  22 uF  [FP-TAJP-MFG]
C67  22 uF  [FP-TAJP-MFG]
C68  10 nF  [FP-CC0805-0_85-MFG]
C69  3.3 nF  [FP-CC0805-0_85-MFG]
C70  10 nF  [FP-CC0805-0_85-MFG]
C71  22 uF  [FP-TAJP-MFG]
C72  0.1 uF  [FP-CC0805-0_85-MFG]
C73  4.7 uF  [FP-CC0805-0_85-MFG]
C74  0.1 uF  [FP-CC0805-0_85-MFG]
C75  1 uF  [FP-CC0805-0_85-MFG]
C76  1 uF  [FP-CC0805-0_85-MFG]
C77  0.1 uF  [FP-CC0805-0_85-MFG]
C78  15 pF  [FP-CC0805-0_85-MFG]
C79  0.1 uF  [FP-CC0805-0_85-MFG]
C80  1 uF  [FP-CC0805-0_85-MFG]
C81  10 nF  [FP-CC0805-0_85-MFG]
C82  10 pF  [FP-CC0805-0_85-MFG]
C83  22 uF  [FP-TAJP-MFG]
C84  0.1 uF  [FP-CC0805-0_85-MFG]
C85  20 pF  [FP-CC0805-0_85-MFG]
C86  10 uF  [FP-CC0805-0_85-MFG]
C87  0.1 uF  [FP-CC0805-0_85-MFG]
C88  15 pF  [FP-CC0805-0_85-MFG]
C89  0.1 uF  [FP-CC0805-0_85-MFG]
C90  1 uF  [FP-CC0805-0_85-MFG]
C91  10 nF  [FP-CC0805-0_85-MFG]
C92  0.1 uF  [FP-CC0805-0_85-MFG]
C93  0.1 uF  [FP-CC0805-0_85-MFG]
C94  1 uF  [FP-CC0805-0_85-MFG]
C95  10 nF  [FP-CC0805-0_85-MFG]
J3  22-05-3031  [FP-22-05-3031-MFG]
L6  1 uH  [FP-LQM21DN_00-IPC_B]
L7  1 uH  [FP-LQM21DN_00-IPC_B]
R43  100  [FP-RR1220-MFG]
R44  100  [FP-RR1220-MFG]
R45  100  [FP-RR1220-MFG]
R46  100  [FP-RR1220-MFG]
R47  100  [FP-RR1220-MFG]
R48  20k  [FP-RR1220-MFG]
R49  5k  [FP-RR1220-MFG]
R50  910  [FP-RR1220-MFG]
R51  10k  [FP-RR1220-MFG]
R52  390  [FP-RR1220-MFG]
R53  10k  [FP-RR1220-MFG]
R54  20  [FP-RR1220-MFG]
R55  5k  [FP-RR1220-MFG]
R56  390  [FP-RR1220-MFG]
R57  20  [FP-RR1220-MFG]
R58  100  [FP-RR1220-MFG]
R59  100  [FP-RR1220-MFG]
R60  100  [FP-RR1220-MFG]
R61  inf  [FP-RR1220-MFG]
R62  0  [FP-RR1220-MFG]
R63  910  [FP-RR1220-MFG]
R64  1k  [FP-RR1220-MFG]
U15  DAC1220E/2K5  [TI-DBQ16_N]
U16  ADR441ARZ  [ADI-R-8_L]  (part A of 2)
U17  ISL28227 ou AD8599ARZ  [ADI-R-8_M]  (parts A,B of 2)
U18  OPA2140AID  [D0008A_N]  (parts A,B of 2)
U19  LMP8350MA/NOPB  [D0008A_L]
U20  AD5543BRMZ  [RM-8_N]

### Blocks framed on the sheet
DAC1220 VOLTAGE REF GEN: C60 C62 C64-C68 C71 R46 U16 U17
2PI CONTROL DAC: C59 C61 C63 C69 C70 C72-C75 L6 R43-R45 R47-R49 U15

### Ports
+xVA (see Multiboard_Analog_Connector[6B]), -xVA (see Multiboard_Analog_Connector[6B]), AD5543_CLK (see Multiboard_Analog_Connector[7A]), AD5543_CS- (see Multiboard_Analog_Connector[7A]), AD5543_SDI (see Multiboard_Analog_Connector[7A]), DAC1220_CS- (see Multiboard_Analog_Connector[6A]), DAC1220_SCLK (see Multiboard_Analog_Connector[6A]), DAC1220_SDIO (see Multiboard_Analog_Connector[6A]), DAC1220_XIN (see Multiboard_Analog_Connector[6A])

### Nets
+5VA: C60.1 C62.1 C64.1 C65.1 C72.1 C73.1 L6.1 L7.1 U15.5(AVDD) U16.2(VIN) U17.8(+V)
+xV: C86.2 C87.2 C89.1 C90.1 C91.1 C92.1 R62.1 U18.8(V+) U19.3(V+) ; port +xVA
-xV: C76.1 C77.1 C79.1 C80.1 C81.1 C92.2 R61.2 U18.4(V-) U19.6(V-) ; port -xVA
GND: C59.2 C60.2 C61.2 C62.2 C63.1 C64.2 C65.2 C66.1(C) C67.1(C) C68.2 C71.1(C) C72.2 C73.2 C74.2 C75.2 C76.2 C77.2 C79.2 C80.2 C81.2 C83.1(C) C84.2 C86.1 C87.1 C89.2 C90.2 C91.2 C93.2 C94.2 J3.1 R56.1 U15.4(DGND) U15.13(AGND) U16.4(GND) U17.4(-V) U18.3(IN_A+) U18.5(IN_B+) U19.2(VOCM) U20.6(GND)
CLK_DA_PI: C63.2 R47.2 ; port DAC1220_XIN
DA_CLK: R58.1 U20.1(CLK)
DA_CLK_SEL: R58.2 ; port AD5543_CLK
DA_CS: U20.8(~{CS}) ; port AD5543_CS-
DA_PI_CLK: R47.1 U15.3(XIN)
DA_PI_CS: R43.2 U15.14(~{CS})
DA_PI_CS_SEL: R43.1 ; port DAC1220_CS-
DA_PI_SCLK: R45.2 U15.16(SCLK)
DA_PI_SDIO: R44.2 U15.15(SDIO)
DA_SDI: R59.1 U20.2(SDI)
DA_SDI_SEL: R59.2 ; port AD5543_SDI
MIOC+: J3.2 R54.2
MIOC-: J3.3 R57.2
MOD_DA_PI_SCLK: R45.1 ; port DAC1220_SCLK
MOD_DA_PI_SDIO: R44.1 ; port DAC1220_SDIO
VREF_DAC1220: C59.1 C61.1 C69.2 R49.1 U15.12(VREF) U17.1(OUT_A) U17.2(-IN_A)
NetC66_2: C66.2(A) R46.2 U16.6(VOUT)
NetC67_2: C67.2(A) C68.1 R46.1 U17.3(+IN_A)
NetC69_1: C69.1 U15.9(C1)
NetC70_1: C70.1 R48.1 U15.11(VOUT)
NetC70_2: C70.2 U15.10(C2)
NetC71_2: C71.2(A) U16.5(TRIM)
NetC74_1: C74.1 C75.1 L6.2 U15.1(DVDD)
NetC78_1: C78.1 R50.2 R54.1 U19.4(OUT+)
NetC78_2: C78.2 R50.1 R52.2 U19.1(IN-)
NetC82_1: C82.1 R52.1 R53.2 U18.1(OUT_A)
NetC82_2: C82.2 R51.2 R53.1 R55.2 U18.2(IN_A-)
NetC83_2: C83.2(A) C84.1 R51.1 R60.2 R64.2 U20.4(VREF)
NetC85_1: C85.1 U18.6(IN_B-) U20.5(IOUT)
NetC85_2: C85.2 R55.1 U18.7(OUT_B) U20.3(RFB)
NetC88_1: C88.1 R57.1 R63.2 U19.5(OUT-)
NetC88_2: C88.2 R56.2 R63.1 U19.8(IN+)
NetC93_1: C93.1 C94.1 L7.2 U20.7(VDD)
NetC95_1: C95.1 R60.1 U17.7(OUT_B)
NetC95_2: C95.2 R64.1 U17.6(-IN_B)
NetR48_2: R48.2 R49.2 U17.5(+IN_B)
NetR61_1: R61.1 R62.2 U19.7(EN)

Not connected (* = marked no-connect by the designer): U15 2(XOUT)* 6(DNC)* 7(DNC)* 8(DNC)*

### Notes on the sheet
- DUAL SUPPLY
- DIFFERENTIAL AMP DRIVE
- (in symbol CMP-2007-04028-2) +

### Library data of the parts
C59-C65 C68-C70 C72-C82 C84-C95 = CMP-1036-04410-2: as C2 on sheet AcquisitionAnalog; ComponentLink2URL: http://www.yageo.com/documents/recent/UPY-GPHC_Y5V_6.3V-to-50V_8.pdf; Category: Cap; Mouser Description: Multilayer Ceramic Capacitors MLCC - SMD/SMT 100nF 25V X7R 10%; Device Class L1: Passive Components; Footprint Url: http://www.yageo.com/exep/pages/download/literatures/UPY-C_GEN_24.pdf; Height: 0.95mm; Digikey Description: CAP CER 0.1UF 25V X7R 0805; Lead Free: Yes; Temperature Range High: +85°C; Temperature: -30°C to +85°C; Ipc Land Pattern Name: CAPC200125X85; Capacitance: 100 nF; Automotive: No; Octopart: https://octopart.com/cc0805krx7r8bb104-yageo-39467766; Device Class L2: Capacitors; Temperature Characteristic: X7R; Voltage Rating: 25 V; ComponentLink2Description: Datasheet; Temperature Range Low: -30°C; Device Class L3: Ceramic Capacitors; RoHS: TRUE; Package: CC0805-0.85
C66 C67 C71 C83 = CMP-2007-04028-2: as C16 on sheet AcquisitionAnalog; Height: 1.5mm; Packaging: Tape and Reel; Max Operating Temperature: 125°C; Lead Free: Lead Free; Length: 2.05mm; RoHS Compliant: Yes; Number of Pins: 2; Case Code (Metric): 2012; Series: TAJ; Height - Seated (Max): 0.059inch; Mount: Surface Mount; REACH SVHC: No SVHC; Depth: 1.35mm; Tolerance: 20%; Case Code (Imperial): 0805; Dielectric Material: Tantalum; Features: General Purpose; Voltage: 10V; Capacitance: 10uF; Package Quantity: 1; Case/Package: 0805; Voltage Rating (DC): 10V; Termination: SMD/SMT; Width: 0.053inch; Min Operating Temperature: -55°C; Voltage Rating: 10V
J3 = CMP-04776-000253-1: CONN HEADER R/A 3POS 2.54MM; Number of Positions: 3; Max Current Rating: 4A; Contact Resistance: 10mR; Voltage Rating (DC): 250V; Gender: Male; Approvals: UL; Insulation Resistance: 50GR; Glow Wire Compliant: Non-compliant; Contact Plating: Tin; Packaging: Bulk; Color: White; Series: 7478; Package Quantity: 2000; Depth: 12.83mm; Mount: Through Hole; Length: 7.62mm; Fastening Type: Friction; Number of Circuits: 3; Lead Pitch: 2.54mm; Housing Color: White; Contact Type: Male Pin; Lead Free: Lead Free; Flammability Rating: UL94 V-0; Halogen Free: Low Halogen; Termination: Solder; Contact Mating Length: 0.264inch; Radiation Hardening: No; Min Operating Temperature: 0°C; Pitch: 2.54mm; RoHS Compliant: Yes; Orientation: Right Angle; Number of Rows: 1; Height: 6.35mm; Max Operating Temperature: 75°C; Voltage Rating: 250V; Contact Material: Brass; Number of Contacts: 3; Housing Material: Nylon; Current Rating: 4A
L6 L7 = CMP-06042-012978-1: as L3 on sheet AcquisitionAnalog; Mount: Surface Mount; Depth: 1.45mm; Current Rating: 50mA; Lead Free: Lead Free; Height - Seated (Max): 0.041inch; Inductance Tolerance: 10%; Min Operating Temperature: -40°C; Height: 0.85mm; Radiation Hardening: No; Width: 1.25mm; Length: 2mm; Case Code (Imperial): 0805; Termination: SMD/SMT; Package Quantity: 1; Max Operating Temperature: 85°C; Case Code (Metric): 2012; Case/Package: 0805; Max DC Current: 50mA; DC Current: 50mA; Military Standard: Not; REACH SVHC: No SVHC; Packaging: Tape and Reel; Tolerance: 10%
R43-R64 = CMP-2001-03560-2: as R1 on sheet Multiboard_Analog_Connector; Packaging: Tape and Reel; Length: 0.079inch; Termination: SMD/SMT; Case Code (Metric): 2012; Voltage Rating (DC): 100V; Height: 0.02inch; Width: 0.049inch; RoHS Compliant: Yes; Tolerance: 0.5%; Case/Package: 0805; Resistance Tolerance: 0.5%; Lead Free: Lead Free; Size Code: 0805; Min Operating Temperature: -55°C; Max Operating Temperature: 125°C; Case Code (Imperial): 0805; Package Quantity: 1; Resistor Type: Thin Film; Number of Terminations: 2; Power Rating: 100mW; Series: RR
U15 = CMP-0004-00314-1: 20-Bit Delta-Sigma Low Power DAC, -40 to 85 degC, 16-pin SOP (DBQ16), Green (RoHS & no Sb/Br); Manufacturer: Texas Instruments; SubFamily: Precision DAC (=<10MSPS); Settling Time(us): 2000; DAC Channels: 1; Interface: Serial SPI; Resolution(Bits): 20; Power Consumption(Typ)(mW): 2.5; PackageDescription: 16-Pin Plastic Small Outline, Body 3.9 x 4.9 mm, Pitch 0.635 mm; PartNumber: DAC1220E/2K5; ComponentLink3Description: Package Specification; Mounting Technology: Surface Mount; ComponentLink2Description: Datasheet; Code_JEDEC: MO-137; DNL(Max)(+/-LSB): 1; PackageVersion: 4073301-2/H, 10/2008; PackageReference: DBQ16; Eco-Plan: Green (RoHS & no Sb/Br); ComponentLink2URL: http://www.ti.com/general/docs/lit/getliterature.tsp?genericPartNumber=DAC1220&fileType=pdf; DatasheetVersion: SBAS082G; INL(Max)(+/-LSB): 1; ComponentLink1URL: http://www.ti.com/; ComponentLink1Description: Manufacturer URL; ComponentLink3URL: http://www.ti.com/litv/pdf/msoi004g
U16 = CMP-0784-00172-1: as U14 on sheet AcquisitionAnalog; Packing: Tube; ComponentLink2URL: http://www.analog.com/static/imported-files/data_sheets/ADR440_441_443_444_445.pdf; PackageVersion: 060506-A, 06/2006; PartNumber: ADR441ARZ; PackageDescription: 8-Pin Standard Small Outline Package, Body 4.9 x 3.9 mm, Pitch 1.27 mm; PackageReference: R-8; ComponentLink2Description: Datasheet; ComponentLink3URL: http://www.analog.com/static/imported-files/packages/PKG_PDF/SOIC_Narrow%20(R)/R_8.pdf; Operating Temp Range: -40 to 125 degC; ComponentLink3Description: Package Specification; ComponentLink1Description: Manufacturer URL; Code_JEDEC: MS-012-AA; ComponentLink1URL: http://www.analog.com/en/index.html; DatasheetVersion: Rev. E; ComponentLink4URL: Product URL:http://www.analog.com/en/special-linear-functions/voltage-references/adr441/products/product.html; Mounting Technology: Surface Mount; ComponentLink4Description: URL Link1
U17 = CMP-0384-01156-2: Double Channel Wide Bandwidth Operational Amplifier, 10 MHz BW, 16 V/us SR, Industrial, 8-pin SOIC (R-8), Tube; Manufacturer: Analog Devices; Generic Part Number: AD8599; Slew Rate: 14V/us; V Span Min: 9V; Amplifiers Per Package: 2; Input Offset Voltage: 10uV; Input Bias Current: 25nA; Iq/Amp: 5.7mA; V Span Max: 30V; Small Signal Bandwidth: 10MHz; PackageDescription: 8-Pin Standard Small Outline Package, Body 3.9 x 4.9 mm, Pitch 1.27 mm; ComponentLink3URL: http://www.analog.com/static/imported-files/packages/PKG_PDF/SOIC_Narrow%20(R)/R_8.pdf; ComponentLink2Description: Datasheet; RevisionNote: Reference Circuit URL fixed; ComponentLink3Description: Package Specification; Code_JEDEC: MS-012-AA; DatasheetVersion: Rev. C; ComponentLink4URL: http://www.analog.com/en/all-operational-amplifiers-op-amps/operational-amplifiers-op-amps/ad8599/products/product.html#product-recommendations; PartNumber: AD8599ARZ; Mounting Technology: Surface Mount; ComponentLink4Description: Reference Circuit; ComponentLink1Description: Manufacturer URL; PackageReference: R-8; ComponentLink1URL: http://www.analog.com/en/index.html; PackageVersion: 060506-A; ComponentLink2URL: http://www.analog.com/static/imported-files/data_sheets/AD8597_8599.pdf
U18 = CMP-0272-00255-3: 11 MHz, Precision, Low Noise, Rail-to-Rail Output, JFET Operational Amplifier, 4.5 to 36 V, -40 to 125 degC, 8-pin SOIC (D8), Green (RoHS & no Sb/Br); Manufacturer: Texas Instruments; CMRR(Min)(dB): 126; Packing: TUBE; Offset Drift(Typ)(uV/C): 0.35; Total Supply Voltage(Min)(+5V is 5, +/-5V is 10): 4.5; Total Supply Voltage(Max)(+5V is 5, +/-5V is 10): 36; Rating: Catalog; Iq per channel(Max)(mA): 2; Slew Rate(Typ)(V/us): 20; Vio (25C)(Max)(mV): 0.12; GBW(Typ)(MHz): 11; Sub Family: High Supply Voltage Amplifier (>=30V), Low Input Bias Current Amp (<=10pA), Low Noise Amp (<=10nV/rtHz), Low Offset Voltage Amplifier (<=500uV), Precision Amplifier; IIB(Max)(pA): 10; ComponentLink3Description: Package Specification; DatasheetVersion: SBOS498A; ComponentLink1Description: Manufacturer URL; Eco-Plan: Green (RoHS & no Sb/Br); ComponentLink1URL: http://www.ti.com/; PartNumber: OPA2140AID; Code_JEDEC: MS-012; Number of Channels: 2; ComponentLink2URL: http://www.ti.com/lit/ds/symlink/opa2140.pdf; PackageDescription: 8-Pin Plastic Small Outline, Body 4.9 x 3.9 mm, Pitch 1.27 mm; Mounting Technology: Surface Mount; PackageReference: D0008A; ComponentLink2Description: Datasheet; PackageVersion: 4040047-3/M, 06/2011; ComponentLink3URL: http://www.ti.com/litv/pdf/msoi002j
U19 = CMP-0055-01616-2: Ultra Low Distortion Fully Differential Precision ADC Driver with Selectable Power Modes, 8-pin Narrow SOIC, 95 Rail; Manufacturer: Texas Instruments; PackageTopMarking: NSZXTT*LMP83*50MA; PowerWise: Y; CompType: Amplifiers; PinCount: 8; Code_IPC: SOIC127P600-8; RoHS: Y; ComponentLink1Description: Datasheet URL; Package Reference: D0008A; Code_JEDEC: MS-012-AA; PackageDescription: SOIC Narrow, 4.9 x 3.9 x 1.45mm, 8 Lead, 1.27mm Pitch; ComponentLink1URL: http://www.ti.com/general/docs/lit/getliterature.tsp?genericPartNumber=LMP8350&fileType=pdf
U20 = CMP-0318-01915-2: Single 16-Bit Current Output Digital-to-Analog Converter with Serial Interface, -40 to +85 degC, RM-8, Pb-Free, Tube; Generic Part Number: AD5543; Manufacturer: Analog Devices; Op Pwr Diss: 55ÂµW; Settling Time: 500ns; Max V+: 5.5V; Resolution (Bits): 16; # DAC Outputs: 1; Single Supply: Yes; Code_JEDEC: MO-187-AA; ComponentLink5URL: http://www.analog.com/en/digital-to-analog-converters/da-converters/ad5543/products/product.html#prod_cross_sell; DatasheetVersion: Rev.F; ComponentLink3Description: Package Specification; RoHS: Y; PartNumber: AD5543BRMZ; ComponentLink2Description: Datasheet; ComponentLink3URL: http://www.analog.com/static/imported-files/packages/PKG_PDF/MSOP%28RM%29/RM_8.pdf; PackageVersion: Aug-2005; ComponentLink4URL: http://www.analog.com/en/digital-to-analog-converters/da-converters/ad5543/products/product.html; PackageReference: RM-8; Mounting Technology: Surface Mount; PackageDescription: 8-Lead Mini Small Outline Package [MSOP]; RevisionNote: Component URL fixed; ComponentLink5Description: Reference Design URL; ComponentLink2URL: http://www.analog.com/static/imported-files/data_sheets/AD5543_5553.pdf; ComponentLink1URL: http://www.analog.com/en/index.html; Packing: Tube; ComponentLink1Description: Manufacturer URL; ComponentLink4Description: Product URL

## Sheet SupplyAnalog.SchDoc
size A3; SheetNumber: 4; SheetTotal: 4
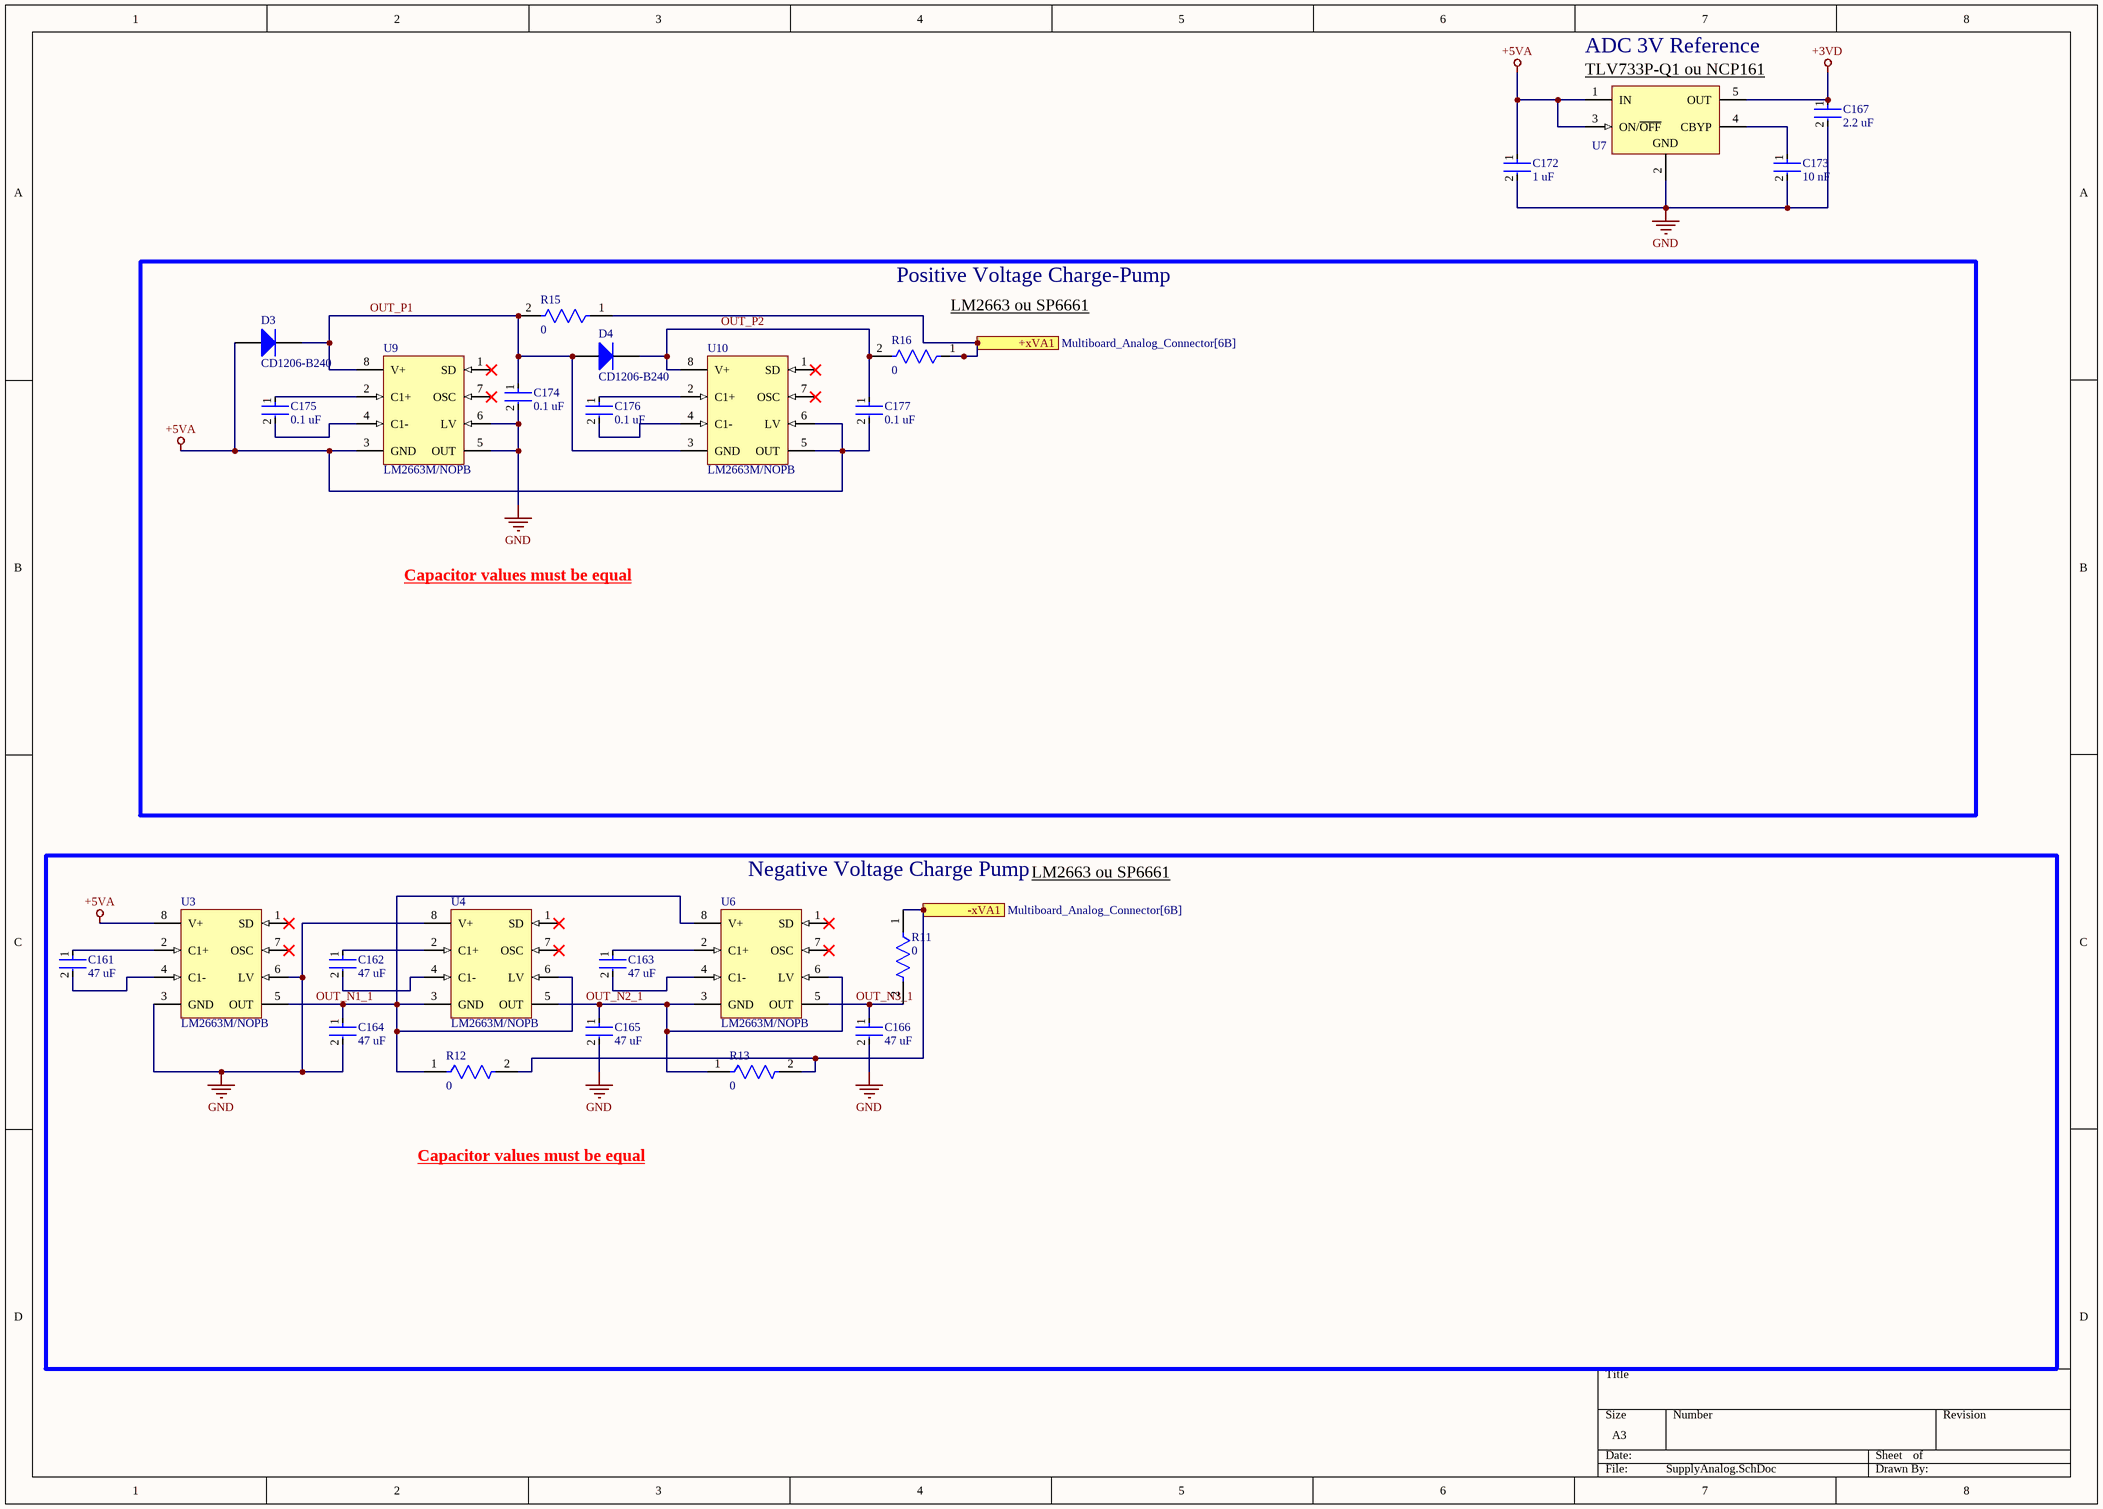
[diagram p3: SupplyAnalog.SchDoc]

### Parts
C161  47 uF  [FP-CC0805-0_85-MFG]
C162  47 uF  [FP-CC0805-0_85-MFG]
C163  47 uF  [FP-CC0805-0_85-MFG]
C164  47 uF  [FP-CC0805-0_85-MFG]
C165  47 uF  [FP-CC0805-0_85-MFG]
C166  47 uF  [FP-CC0805-0_85-MFG]
C167  2.2 uF  [FP-CC0805-0_85-MFG]
C172  1 uF  [FP-CC0805-0_85-MFG]
C173  10 nF  [FP-CC0805-0_85-MFG]
C174  0.1 uF  [FP-CC0805-0_85-MFG]
C175  0.1 uF  [FP-CC0805-0_85-MFG]
C176  0.1 uF  [FP-CC0805-0_85-MFG]
C177  0.1 uF  [FP-CC0805-0_85-MFG]
D3  CD1206-B240  [BOUR-CD1206-S01575-2_L]
D4  CD1206-B240  [BOUR-CD1206-S01575-2_L]
R11  0  [FP-RR1220-MFG]
R12  0  [FP-RR1220-MFG]
R13  0  [FP-RR1220-MFG]
R15  0  [FP-RR1220-MFG]
R16  0  [FP-RR1220-MFG]
U3  LM2663M/NOPB  [D0008A_N]
U4  LM2663M/NOPB  [D0008A_N]
U6  LM2663M/NOPB  [D0008A_N]
U7  LP2985AIM5-3.0/NOPB  [MF05A_L]  (value not drawn)
U9  LM2663M/NOPB  [D0008A_N]
U10  LM2663M/NOPB  [D0008A_N]

### Blocks framed on the sheet
Positive Voltage Charge-Pump: C174-C177 D3 D4 R15 R16 U9 U10
Negative Voltage Charge Pump: C161-C166 R11-R13 U3 U4 U6

### Ports
+xVA1 (see Multiboard_Analog_Connector[6B]), -xVA1 (see Multiboard_Analog_Connector[6B])

### Nets
+3VD: C167.1 U7.5(OUT)
+5VA: C172.1 C177.2 D3.1(A) U3.8(V+) U7.1(IN) U7.3(ON/~{OFF}) U9.3(GND) U10.5(OUT) U10.6(LV)
+xV: R15.1 R16.1 ; port +xVA1
-xV: R11.1 R12.2 R13.2 ; port -xVA1
GND: C164.2 C165.2 C166.2 C167.2 C172.2 C173.2 C174.2 U3.3(GND) U3.6(LV) U4.8(V+) U7.2(GND) U9.5(OUT) U9.6(LV)
OUT_N1_1: C164.1 R12.1 U3.5(OUT) U4.3(GND) U4.6(LV) U6.8(V+)
OUT_N2_1: C165.1 R13.1 U4.5(OUT) U6.3(GND) U6.6(LV)
OUT_N3_1: C166.1 R11.2 U6.5(OUT)
OUT_P1: C174.1 D3.2(K) D4.1(A) R15.2 U9.8(V+) U10.3(GND)
OUT_P2: C177.1 D4.2(K) R16.2 U10.8(V+)
NetC161_1: C161.1 U3.2(C1+)
NetC161_2: C161.2 U3.4(C1-)
NetC162_1: C162.1 U4.2(C1+)
NetC162_2: C162.2 U4.4(C1-)
NetC163_1: C163.1 U6.2(C1+)
NetC163_2: C163.2 U6.4(C1-)
NetC173_1: C173.1 U7.4(CBYP)
NetC175_1: C175.1 U9.2(C1+)
NetC175_2: C175.2 U9.4(C1-)
NetC176_1: C176.1 U10.2(C1+)
NetC176_2: C176.2 U10.4(C1-)

Not connected (* = marked no-connect by the designer): U3 1(SD)* 7(OSC)*; U4 1(SD)* 7(OSC)*; U6 1(SD)* 7(OSC)*; U9 1(SD)* 7(OSC)*; U10 1(SD)* 7(OSC)*

### Notes on the sheet
- (near U7) ADC 3V Reference
- (near U7) TLV733P-Q1 ou NCP161
- (near R16) LM2663 ou SP6661
- Capacitor values must be equal
- LM2663 ou SP6661

### Library data of the parts
C161-C167 C172-C177 = CMP-1036-04410-2: as C2 on sheet AcquisitionAnalog; ComponentLink2URL: http://www.yageo.com/documents/recent/UPY-GPHC_Y5V_6.3V-to-50V_8.pdf; Category: Cap; Mouser Description: Multilayer Ceramic Capacitors MLCC - SMD/SMT 100nF 25V X7R 10%; Device Class L1: Passive Components; Footprint Url: http://www.yageo.com/exep/pages/download/literatures/UPY-C_GEN_24.pdf; Height: 0.95mm; Digikey Description: CAP CER 0.1UF 25V X7R 0805; Lead Free: Yes; Temperature Range High: +85°C; Temperature: -30°C to +85°C; Ipc Land Pattern Name: CAPC200125X85; Capacitance: 100 nF; Automotive: No; Octopart: https://octopart.com/cc0805krx7r8bb104-yageo-39467766; Device Class L2: Capacitors; Temperature Characteristic: X7R; Voltage Rating: 25 V; ComponentLink2Description: Datasheet; Temperature Range Low: -30°C; Device Class L3: Ceramic Capacitors; RoHS: TRUE; Package: CC0805-0.85
D3 D4 = CMP-0583-00001-2: 75 V Small Signal Switching Diode, 150 mA, 2.5 uA, 1026 Molded Package, RoHS, Tape and Reel; Manufacturer: Bourns; PartNumber: CD1206-S01575; Reverse Voltage: 75 V; Average Forward Current: 150 mA; Reverse Current (Max.): 2.5 uA; Capacitance Between Terminals (Max.): 3 pF; Reverse Recovery Time (Max.): 4 nS; Forward Voltage (Max.): 1.00 V; Packing: Tape and Reel; Mounting Technology: Surface Mount; DatasheetVersion: Rev. 06/11; ComponentLink2URL: http://www.bourns.com/data/global/pdfs/CD1206_S01575.pdf; PackageReference: CD1206-S01575-2; RoHS: TRUE; ComponentLink1URL: http://www.bourns.com/; ComponentLink1Description: Manufacturer URL; ComponentLink3Description: Package Specification; ComponentLink3URL: http://www.bourns.com/data/global/pdfs/CD1206_S01575.pdf; ComponentLink2Description: Datasheet; PackageDescription: 2-Pin SMD, Body 3.2 x 1.5 mm
R11-R13 R15 R16 = CMP-2001-03560-2: as R1 on sheet Multiboard_Analog_Connector; Packaging: Tape and Reel; Length: 0.079inch; Termination: SMD/SMT; Case Code (Metric): 2012; Voltage Rating (DC): 100V; Height: 0.02inch; Width: 0.049inch; RoHS Compliant: Yes; Tolerance: 0.5%; Case/Package: 0805; Resistance Tolerance: 0.5%; Lead Free: Lead Free; Size Code: 0805; Min Operating Temperature: -55°C; Max Operating Temperature: 125°C; Case Code (Imperial): 0805; Package Quantity: 1; Resistor Type: Thin Film; Number of Terminations: 2; Power Rating: 100mW; Series: RR
U3 U4 U6 U9 U10 = CMP-0065-00037-3: Switched Capacitor Voltage Converter, 8-pin Narrow SOIC, Pb-Free; Manufacturer: Texas Instruments; PackageTopMarking: NSZXTT*LM26*63M; CompType: Switch Caps; PowerWise: N; Code_IPC: SOIC127P600-8; PinCount: 8; ComponentLink1Description: Datasheet URL; PackageReference: D0008A; Code_JEDEC: MS-012-AA; PackageDescription: SOIC Narrow, 4.9 x 3.9 x 1.45mm, 8 Lead, 1.27mm Pitch; ComponentLink1URL: http://www.ti.com/general/docs/lit/getliterature.tsp?genericPartNumber=LM2663&fileType=pdf; RoHS: Y
U7 = CMP-0062-02011-2: Micropower 150 mA Low-Noise Ultra Low-Dropout Regulator, 5-pin SOT-23, Pb-Free; Manufacturer: National Semiconductor; PackageTopMarking: L0OA*XTT; PowerWise: N; CompType: LDO IC; ComponentLink3Description: MF05A Package Page; RoHS: Y; PackageVersion: revD, Aug-2008; PinCount: 5; RevisionNote: Component URLs added; PackageReference: MF05A; PackageDescription: Molded SOT-23, .115 x .063 x .040 in Body, 5 Lead, .0375 in Pitch; ComponentLink2Description: LP2985 Web Page; ComponentLink1URL: http://www.national.com/ds/LP/LP2985.pdf; DatasheetVersion: Jul-2007; ComponentLink2URL: http://www.national.com/pf/LP/LP2985.html; ComponentLink1Description: LP2985 Datasheet; ComponentLink3URL: http://www.national.com/packaging/folders/mf05a.html

## Nets that join several sheets
+3VD: AcquisitionAnalog (L3.1 L4.2 L5.1), SupplyAnalog (C167.1 U7.5)
+5VA: Multiboard_Analog_Connector (10 pins), AcquisitionAnalog (28 pins), ModulationAnalog (11 pins), SupplyAnalog (9 pins)
+xV: Multiboard_Analog_Connector (R81.2 R82.2), ModulationAnalog (9 pins), SupplyAnalog (R15.1 R16.1)
-xV: Multiboard_Analog_Connector (R83.2 R84.2), ModulationAnalog (9 pins), SupplyAnalog (R11.1 R12.2 R13.2)
GND: Multiboard_Analog_Connector (11 pins), AcquisitionAnalog (81 pins), ModulationAnalog (39 pins), SupplyAnalog (13 pins)
AD_CLK_IN: Multiboard_Analog_Connector (J1.57), AcquisitionAnalog (U1.55)
AD_COMMON_DOUT: Multiboard_Analog_Connector (J1.60), AcquisitionAnalog (U1.44)
AD_COMMON_SCLK: Multiboard_Analog_Connector (J1.58), AcquisitionAnalog (R34.1)
AD_CS_SEL: Multiboard_Analog_Connector (R5.1 R6.1 R7.1 R8.1), AcquisitionAnalog (R35.1)
AD_DRDY_SEL: Multiboard_Analog_Connector (R1.1 R2.1 R3.1 R4.1), AcquisitionAnalog (U1.46)
AD_START_SEL: Multiboard_Analog_Connector (R9.1 R10.1 R14.1 R65.1), AcquisitionAnalog (R38.1)
CLK_DA_PI: Multiboard_Analog_Connector (J1.22), ModulationAnalog (C63.2 R47.2)
DA_CLK_SEL: Multiboard_Analog_Connector (R69.1 R70.1 R71.1 R72.1), ModulationAnalog (R58.2)
DA_CS: Multiboard_Analog_Connector (R66.1 R67.1 R68.1), ModulationAnalog (U20.8)
DA_PI_CS_SEL: Multiboard_Analog_Connector (R77.1 R78.1 R79.1 R80.1), ModulationAnalog (R43.1)
DA_SDI_SEL: Multiboard_Analog_Connector (R73.1 R74.1 R75.1 R76.1), ModulationAnalog (R59.2)
MOD_DA_PI_SCLK: Multiboard_Analog_Connector (J1.25), ModulationAnalog (R45.1)
MOD_DA_PI_SDIO: Multiboard_Analog_Connector (J1.23), ModulationAnalog (R44.1)